# EAGLE design MotherboardRev1 (EAGLE 7.3.0)

## Sheet 1 of 8
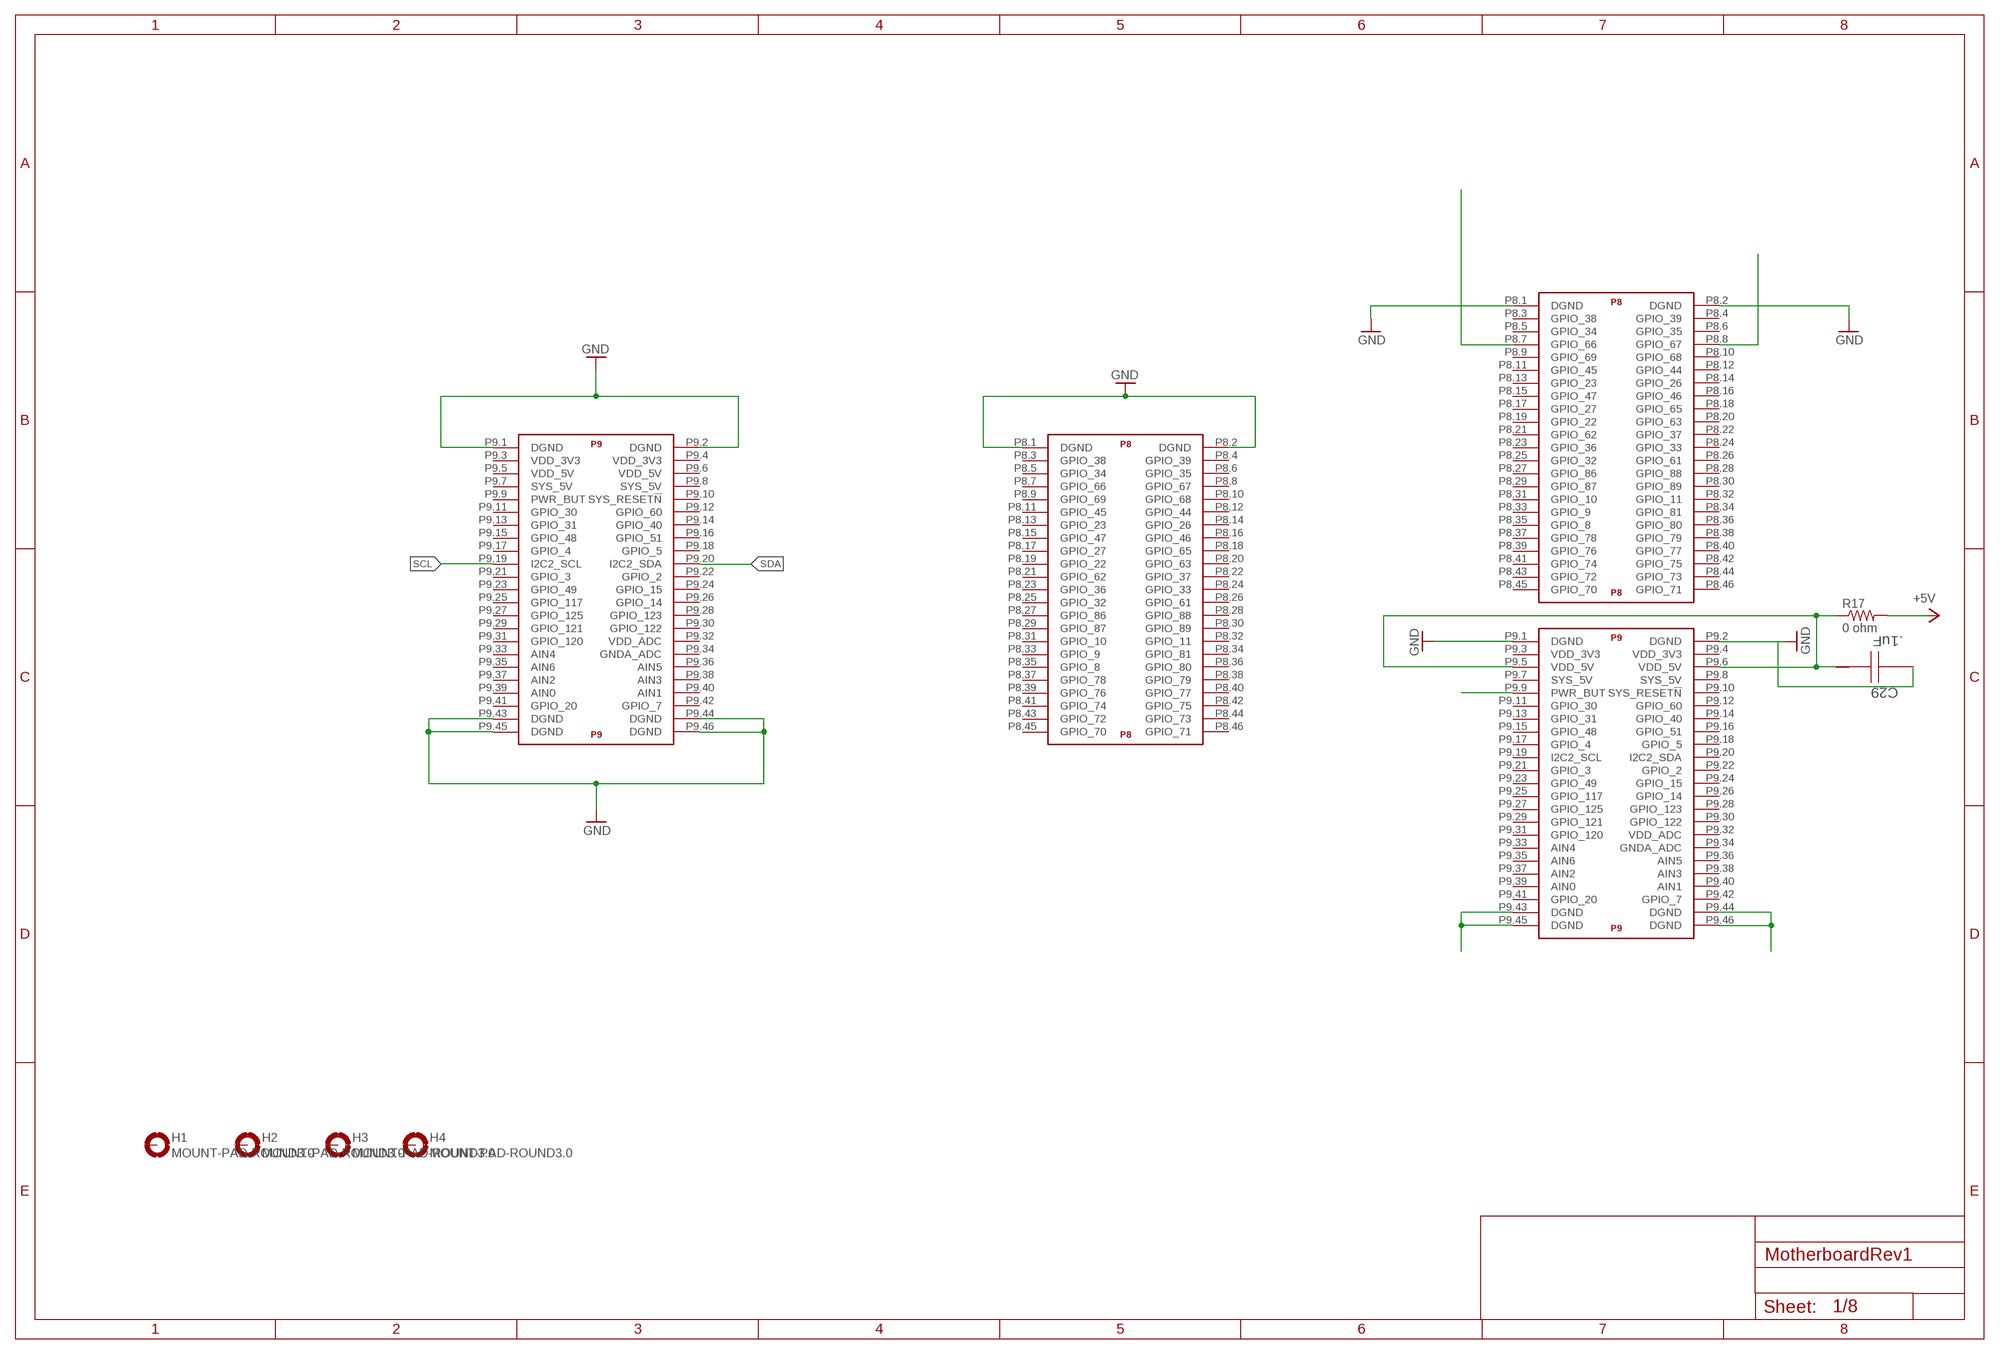
[diagram p0: schematic, sheet 1]

### Parts
C29  .1uF  C3216X5R1A106K  [1206]
H1  MOUNT-PAD-ROUND3.0  [3,0-PAD]
H2  MOUNT-PAD-ROUND3.0  [3,0-PAD]
H3  MOUNT-PAD-ROUND3.0  [3,0-PAD]
H4  MOUNT-PAD-ROUND3.0  [3,0-PAD]
R17  0 ohm  R-US_R1206  [R1206]
U$1  BEAGLE_BONE_BLACK_CAPE  [BEAGLE_BONE_BLACK_CAPE]
U$3  BEAGLE_BONE_BLACK_CAPE  [BEAGLE_BONE_BLACK_CAPE]

### Nets
+5V: R17.2 ; also sheet 3
BB_PWR_SW: U$3.P9.9(P9:PWR_BUT)
GND: C29.2 U$1.P8.1(P8:DGND) U$1.P8.2(P8:DGND) U$1.P9.1(P9:DGND) U$1.P9.2(P9:DGND) U$1.P9.43(P9:DGND) U$1.P9.44(P9:DGND) U$1.P9.45(P9:DGND) U$1.P9.46(P9:DGND) U$3.P8.1(P8:DGND) U$3.P8.2(P8:DGND) U$3.P9.1(P9:DGND) U$3.P9.2(P9:DGND) U$3.P9.43(P9:DGND) U$3.P9.44(P9:DGND) U$3.P9.45(P9:DGND) U$3.P9.46(P9:DGND) ; also sheet 5,6,7,8
N$11: C29.1 R17.1 U$3.P9.5(P9:VDD_5V) U$3.P9.6(P9:VDD_5V)
N$12: U$3.P8.7(P8:GPIO_66)
N$14: U$3.P8.8(P8:GPIO_67)
SCL: U$1.P9.19(P9:I2C2_SCL) ; also sheet 2
SDA: U$1.P9.20(P9:I2C2_SDA) ; also sheet 2
Unconnected: H1.B3,0(MOUNT) H2.B3,0(MOUNT) H3.B3,0(MOUNT) H4.B3,0(MOUNT) U$1.P8.3(P8:GPIO_38) U$1.P8.4(P8:GPIO_39) U$1.P8.5(P8:GPIO_34) U$1.P8.6(P8:GPIO_35) U$1.P8.7(P8:GPIO_66) U$1.P8.8(P8:GPIO_67) U$1.P8.9(P8:GPIO_69) U$1.P8.10(P8:GPIO_68) U$1.P8.11(P8:GPIO_45) U$1.P8.12(P8:GPIO_44) U$1.P8.13(P8:GPIO_23) U$1.P8.14(P8:GPIO_26) U$1.P8.15(P8:GPIO_47) U$1.P8.16(P8:GPIO_46) U$1.P8.17(P8:GPIO_27) U$1.P8.18(P8:GPIO_65) U$1.P8.19(P8:GPIO_22) U$1.P8.20(P8:GPIO_63) U$1.P8.21(P8:GPIO_62) U$1.P8.22(P8:GPIO_37) U$1.P8.23(P8:GPIO_36) U$1.P8.24(P8:GPIO_33) U$1.P8.25(P8:GPIO_32) U$1.P8.26(P8:GPIO_61) U$1.P8.27(P8:GPIO_86) U$1.P8.28(P8:GPIO_88) U$1.P8.29(P8:GPIO_87) U$1.P8.30(P8:GPIO_89) U$1.P8.31(P8:GPIO_10) U$1.P8.32(P8:GPIO_11) U$1.P8.33(P8:GPIO_9) U$1.P8.34(P8:GPIO_81) U$1.P8.35(P8:GPIO_8) U$1.P8.36(P8:GPIO_80) U$1.P8.37(P8:GPIO_78) U$1.P8.38(P8:GPIO_79) U$1.P8.39(P8:GPIO_76) U$1.P8.40(P8:GPIO_77) U$1.P8.41(P8:GPIO_74) U$1.P8.42(P8:GPIO_75) U$1.P8.43(P8:GPIO_72) U$1.P8.44(P8:GPIO_73) U$1.P8.45(P8:GPIO_70) U$1.P8.46(P8:GPIO_71) U$1.P9.3(P9:VDD_3V3) U$1.P9.4(P9:VDD_3V3) U$1.P9.5(P9:VDD_5V) U$1.P9.6(P9:VDD_5V) U$1.P9.7(P9:SYS_5V) U$1.P9.8(P9:SYS_5V) U$1.P9.9(P9:PWR_BUT) U$1.P9.10(P9:SYS_RESET!N) U$1.P9.11(P9:GPIO_30) U$1.P9.12(P9:GPIO_60) U$1.P9.13(P9:GPIO_31) U$1.P9.14(P9:GPIO_40) U$1.P9.15(P9:GPIO_48) U$1.P9.16(P9:GPIO_51) U$1.P9.17(P9:GPIO_4) U$1.P9.18(P9:GPIO_5) U$1.P9.21(P9:GPIO_3) U$1.P9.22(P9:GPIO_2) U$1.P9.23(P9:GPIO_49) U$1.P9.24(P9:GPIO_15) U$1.P9.25(P9:GPIO_117) U$1.P9.26(P9:GPIO_14) U$1.P9.27(P9:GPIO_125) U$1.P9.28(P9:GPIO_123) U$1.P9.29(P9:GPIO_121) U$1.P9.30(P9:GPIO_122) U$1.P9.31(P9:GPIO_120) U$1.P9.32(P9:VDD_ADC) U$1.P9.33(P9:AIN4) U$1.P9.34(P9:GNDA_ADC) U$1.P9.35(P9:AIN6) U$1.P9.36(P9:AIN5) U$1.P9.37(P9:AIN2) U$1.P9.38(P9:AIN3) U$1.P9.39(P9:AIN0) U$1.P9.40(P9:AIN1) U$1.P9.41(P9:GPIO_20) U$1.P9.42(P9:GPIO_7) U$3.P8.3(P8:GPIO_38) U$3.P8.4(P8:GPIO_39) U$3.P8.5(P8:GPIO_34) U$3.P8.6(P8:GPIO_35) U$3.P8.9(P8:GPIO_69) U$3.P8.10(P8:GPIO_68) U$3.P8.11(P8:GPIO_45) U$3.P8.12(P8:GPIO_44) U$3.P8.13(P8:GPIO_23) U$3.P8.14(P8:GPIO_26) U$3.P8.15(P8:GPIO_47) U$3.P8.16(P8:GPIO_46) U$3.P8.17(P8:GPIO_27) U$3.P8.18(P8:GPIO_65) U$3.P8.19(P8:GPIO_22) U$3.P8.20(P8:GPIO_63) U$3.P8.21(P8:GPIO_62) U$3.P8.22(P8:GPIO_37) U$3.P8.23(P8:GPIO_36) U$3.P8.24(P8:GPIO_33) U$3.P8.25(P8:GPIO_32) U$3.P8.26(P8:GPIO_61) U$3.P8.27(P8:GPIO_86) U$3.P8.28(P8:GPIO_88) U$3.P8.29(P8:GPIO_87) U$3.P8.30(P8:GPIO_89) U$3.P8.31(P8:GPIO_10) U$3.P8.32(P8:GPIO_11) U$3.P8.33(P8:GPIO_9) U$3.P8.34(P8:GPIO_81) U$3.P8.35(P8:GPIO_8) U$3.P8.36(P8:GPIO_80) U$3.P8.37(P8:GPIO_78) U$3.P8.38(P8:GPIO_79) U$3.P8.39(P8:GPIO_76) U$3.P8.40(P8:GPIO_77) U$3.P8.41(P8:GPIO_74) U$3.P8.42(P8:GPIO_75) U$3.P8.43(P8:GPIO_72) U$3.P8.44(P8:GPIO_73) U$3.P8.45(P8:GPIO_70) U$3.P8.46(P8:GPIO_71) U$3.P9.3(P9:VDD_3V3) U$3.P9.4(P9:VDD_3V3) U$3.P9.7(P9:SYS_5V) U$3.P9.8(P9:SYS_5V) U$3.P9.10(P9:SYS_RESET!N) U$3.P9.11(P9:GPIO_30) U$3.P9.12(P9:GPIO_60) U$3.P9.13(P9:GPIO_31) U$3.P9.14(P9:GPIO_40) U$3.P9.15(P9:GPIO_48) U$3.P9.16(P9:GPIO_51) U$3.P9.17(P9:GPIO_4) U$3.P9.18(P9:GPIO_5) U$3.P9.19(P9:I2C2_SCL) U$3.P9.20(P9:I2C2_SDA) U$3.P9.21(P9:GPIO_3) U$3.P9.22(P9:GPIO_2) U$3.P9.23(P9:GPIO_49) U$3.P9.24(P9:GPIO_15) U$3.P9.25(P9:GPIO_117) U$3.P9.26(P9:GPIO_14) U$3.P9.27(P9:GPIO_125) U$3.P9.28(P9:GPIO_123) U$3.P9.29(P9:GPIO_121) U$3.P9.30(P9:GPIO_122) U$3.P9.31(P9:GPIO_120) U$3.P9.32(P9:VDD_ADC) U$3.P9.33(P9:AIN4) U$3.P9.34(P9:GNDA_ADC) U$3.P9.35(P9:AIN6) U$3.P9.36(P9:AIN5) U$3.P9.37(P9:AIN2) U$3.P9.38(P9:AIN3) U$3.P9.39(P9:AIN0) U$3.P9.40(P9:AIN1) U$3.P9.41(P9:GPIO_20) U$3.P9.42(P9:GPIO_7)

## Sheet 2 of 8
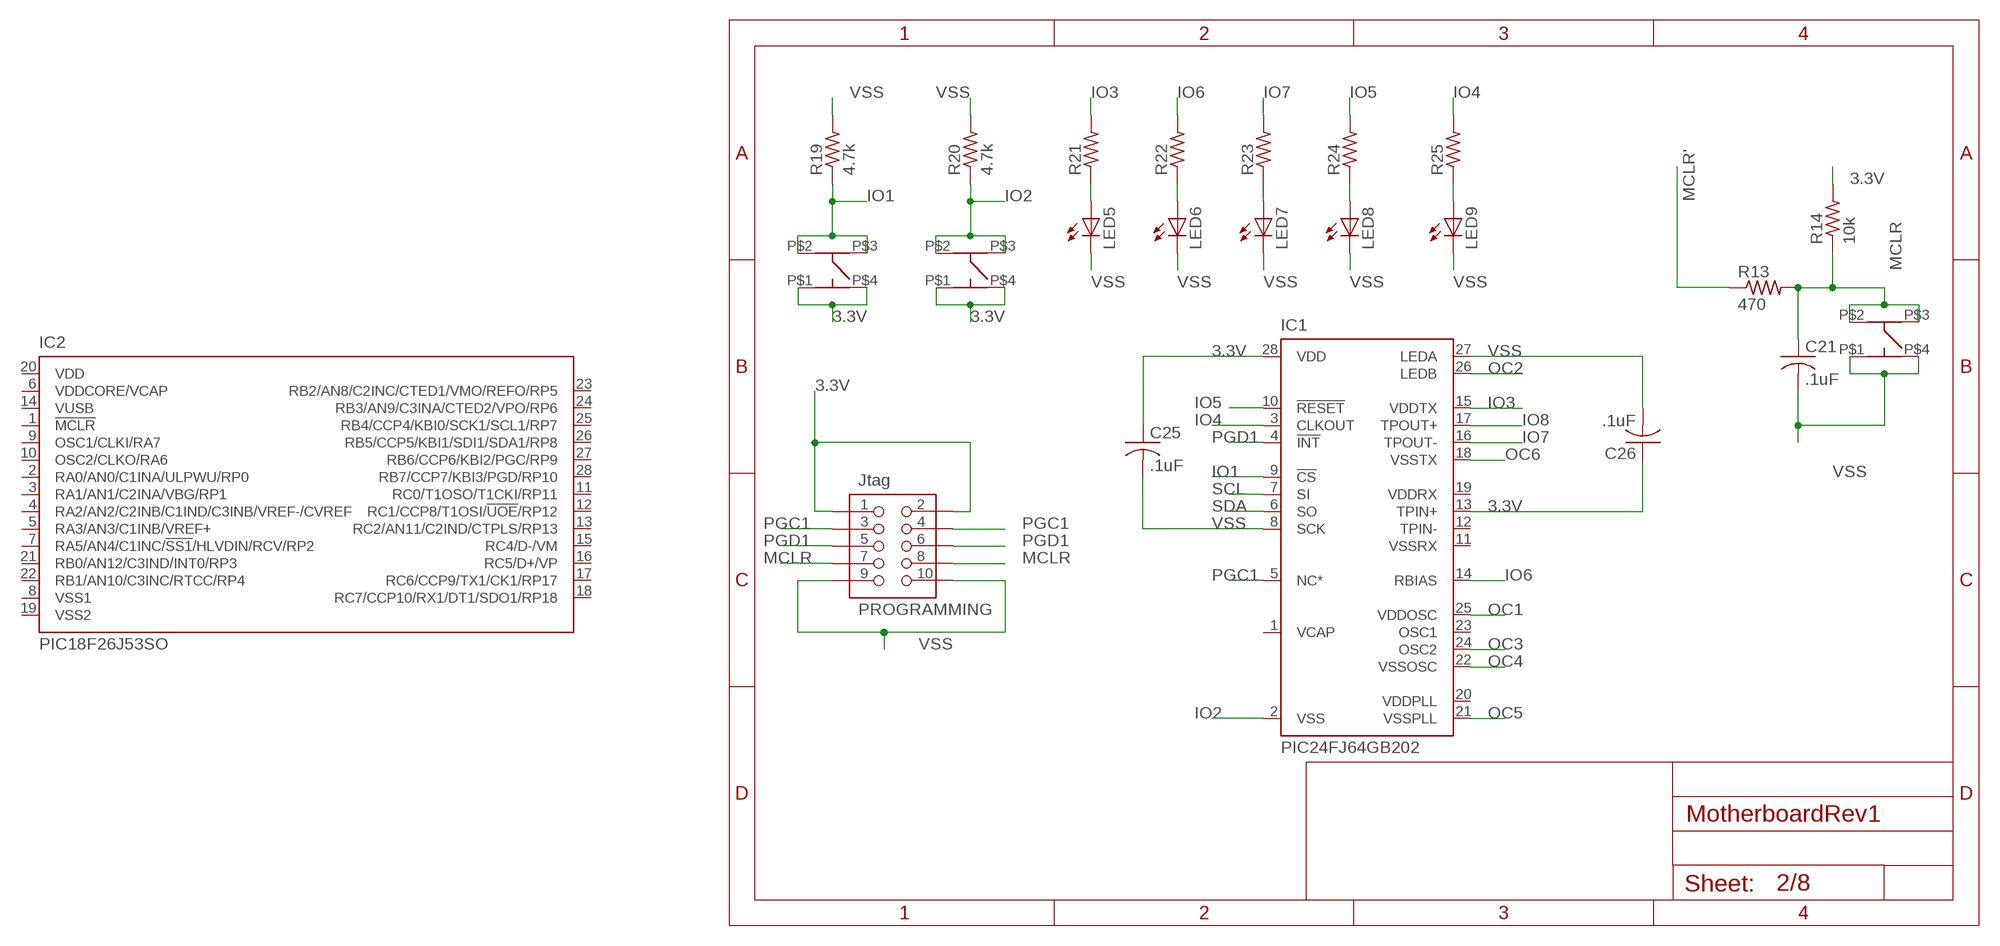
[diagram p1: schematic, sheet 2]

### Parts
C21  .1uF  C-USC0805  [C0805]
C25  .1uF  C-USC0805  [C0805]
C26  .1uF  C-USC0805  [C0805]
IC1  PIC24FJ64GB202  ENC28J60SP  [DIL28-3]
IC2  PIC18F26J53SO  [SO28W]
LED5  LED_LEDCHIPLED_1206  [LED_CHIPLED_1206]
LED6  LED_LEDCHIPLED_1206  [LED_CHIPLED_1206]
LED7  LED_LEDCHIPLED_1206  [LED_CHIPLED_1206]
LED8  LED_LEDCHIPLED_1206  [LED_CHIPLED_1206]
LED9  LED_LEDCHIPLED_1206  [LED_CHIPLED_1206]
PROGRAMMING  Jtag  MOTHER-BOARD-REV5_PIN-CONNECTOR74089  [MOTHER-BOARD-REV5_10-PIN-SMD]
R13  470  R-US_R0805  [R0805]
R14  10k  R-US_R0805  [R0805]
R19  4.7k  R-US_R0805  [R0805]
R20  4.7k  R-US_R0805  [R0805]
R21  R-US_M0805  [M0805]
R22  R-US_M0805  [M0805]
R23  R-US_M0805  [M0805]
R24  R-US_M0805  [M0805]
R25  R-US_M0805  [M0805]
U$5  Switch3  MC32882_SW  [MC32882_FINAL]
U$6  Switch1  MC32882_SW  [MC32882_FINAL]
U$7  Switch2  MC32882_SW  [MC32882_FINAL]

### Nets
3.3V: C25.1 C26.1 IC1.13(TPIN+) IC1.28(VDD) PROGRAMMING.1 PROGRAMMING.2 R14.2 U$6.P$1(P1) U$6.P$4(P4) U$7.P$1(P1) U$7.P$4(P4) ; also sheet 3
IO1: IC1.9(!CS) R19.1 U$6.P$2(P2) U$6.P$3(P3)
IO2: IC1.2(VSS) R20.1 U$7.P$2(P2) U$7.P$3(P3)
IO3: IC1.15(VDDTX) R21.2
IO4: IC1.3(CLKOUT) R25.2
IO5: IC1.10(!RESET) R24.2
IO6: IC1.14(RBIAS) R22.2
IO7: IC1.16(TPOUT-) R23.2
IO8: IC1.17(TPOUT+)
MCLR: C21.1 PROGRAMMING.7 PROGRAMMING.8 R13.2 R14.1 U$5.P$2(P2) U$5.P$3(P3)
MCLR': R13.1
N$5: LED5.A R21.1
N$6: LED6.A R22.1
N$7: LED7.A R23.1
N$8: LED8.A R24.1
N$9: LED9.A R25.1
OC1: IC1.25(VDDOSC) ; also sheet 4
OC2: IC1.26(LEDB) ; also sheet 4
OC3: IC1.24(OSC2) ; also sheet 4
OC4: IC1.22(VSSOSC) ; also sheet 4
OC5: IC1.21(VSSPLL) ; also sheet 4
OC6: IC1.18(VSSTX) ; also sheet 4
PGC1: IC1.5(NC*) PROGRAMMING.3 PROGRAMMING.4
PGD1: IC1.4(!INT) PROGRAMMING.5 PROGRAMMING.6
SCL: IC1.7(SI) ; also sheet 1
SDA: IC1.6(SO) ; also sheet 1
VSS: C21.2 C25.2 C26.2 IC1.8(SCK) IC1.27(LEDA) LED5.C LED6.C LED7.C LED8.C LED9.C PROGRAMMING.9 PROGRAMMING.10 R19.2 R20.2 U$5.P$1(P1) U$5.P$4(P4) ; also sheet 3,4
Unconnected: IC1.1(VCAP) IC1.11(VSSRX) IC1.12(TPIN-) IC1.19(VDDRX) IC1.20(VDDPLL) IC1.23(OSC1) IC2.1(!MCLR) IC2.2(RA0/AN0/C1INA/ULPWU/RP0) IC2.3(RA1/AN1/C2INA/VBG/RP1) IC2.4(RA2/AN2/C2INB/C1IND/C3INB/VREF-/CVREF) IC2.5(RA3/AN3/C1INB/VREF+) IC2.6(VDDCORE/VCAP) IC2.7(RA5/AN4/C1INC/!SS1!/HLVDIN/RCV/RP2) IC2.8(VSS1) IC2.9(OSC1/CLKI/RA7) IC2.10(OSC2/CLKO/RA6) IC2.11(RC0/T1OSO/T1CKI/RP11) IC2.12(RC1/CCP8/T1OSI/!UOE!/RP12) IC2.13(RC2/AN11/C2IND/CTPLS/RP13) IC2.14(VUSB) IC2.15(RC4/D-/VM) IC2.16(RC5/D+/VP) IC2.17(RC6/CCP9/TX1/CK1/RP17) IC2.18(RC7/CCP10/RX1/DT1/SDO1/RP18) IC2.19(VSS2) IC2.20(VDD) IC2.21(RB0/AN12/C3IND/INT0/RP3) IC2.22(RB1/AN10/C3INC/RTCC/RP4) IC2.23(RB2/AN8/C2INC/CTED1/VMO/REFO/RP5) IC2.24(RB3/AN9/C3INA/CTED2/VPO/RP6) IC2.25(RB4/CCP4/KBI0/SCK1/SCL1/RP7) IC2.26(RB5/CCP5/KBI1/SDI1/SDA1/RP8) IC2.27(RB6/CCP6/KBI2/PGC/RP9) IC2.28(RB7/CCP7/KBI3/PGD/RP10)

## Sheet 3 of 8: Power System
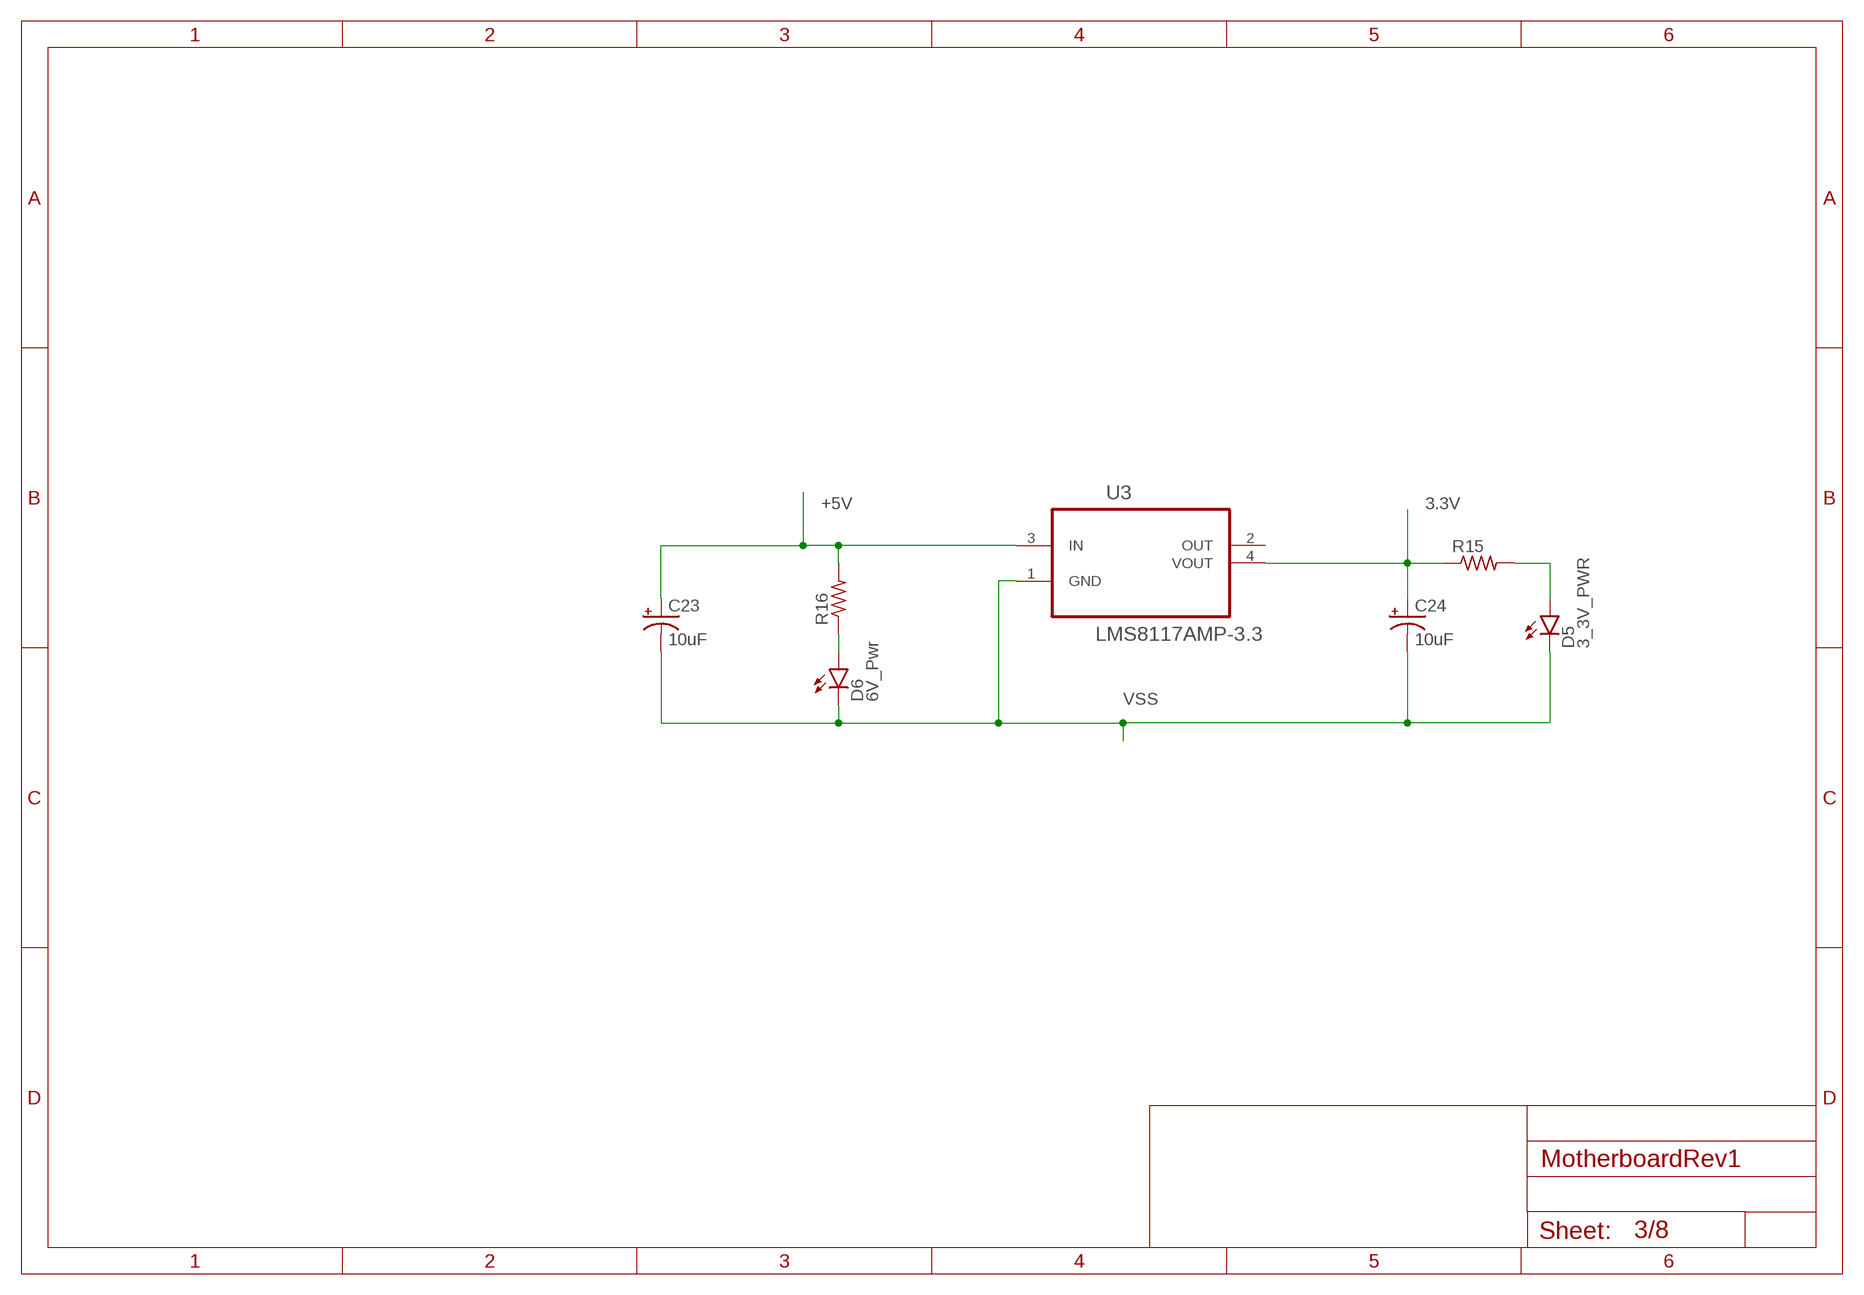
[diagram p2: schematic, sheet 3]

### Parts
C23  10uF  10UF-16V-10%(TANT)  [EIA3216]
C24  10uF  10UF-16V-10%(TANT)  [EIA3216]
D5  3_3V_PWR  LED-FKIT-1206  [FKIT-LED-1206]
D6  6V_Pwr  LED-FKIT-1206  [FKIT-LED-1206]
R15  R-US_R0805W  [R0805W]
R16  R-US_R0805W  [R0805W]
U3  LMS8117AMP-3.3  [SOT230P696X180-4N]

### Nets
3.3V: C24.A(+) R15.1 U3.4(VOUT) ; also sheet 2
+5V: C23.A(+) R16.2 U3.3(IN) ; also sheet 1
N$10: D5.A R15.2
N$13: D6.A R16.1
VSS: C23.C(-) C24.C(-) D5.C D6.C U3.1(GND) ; also sheet 2,4
Unconnected: U3.2(OUT)

## Sheet 4 of 8
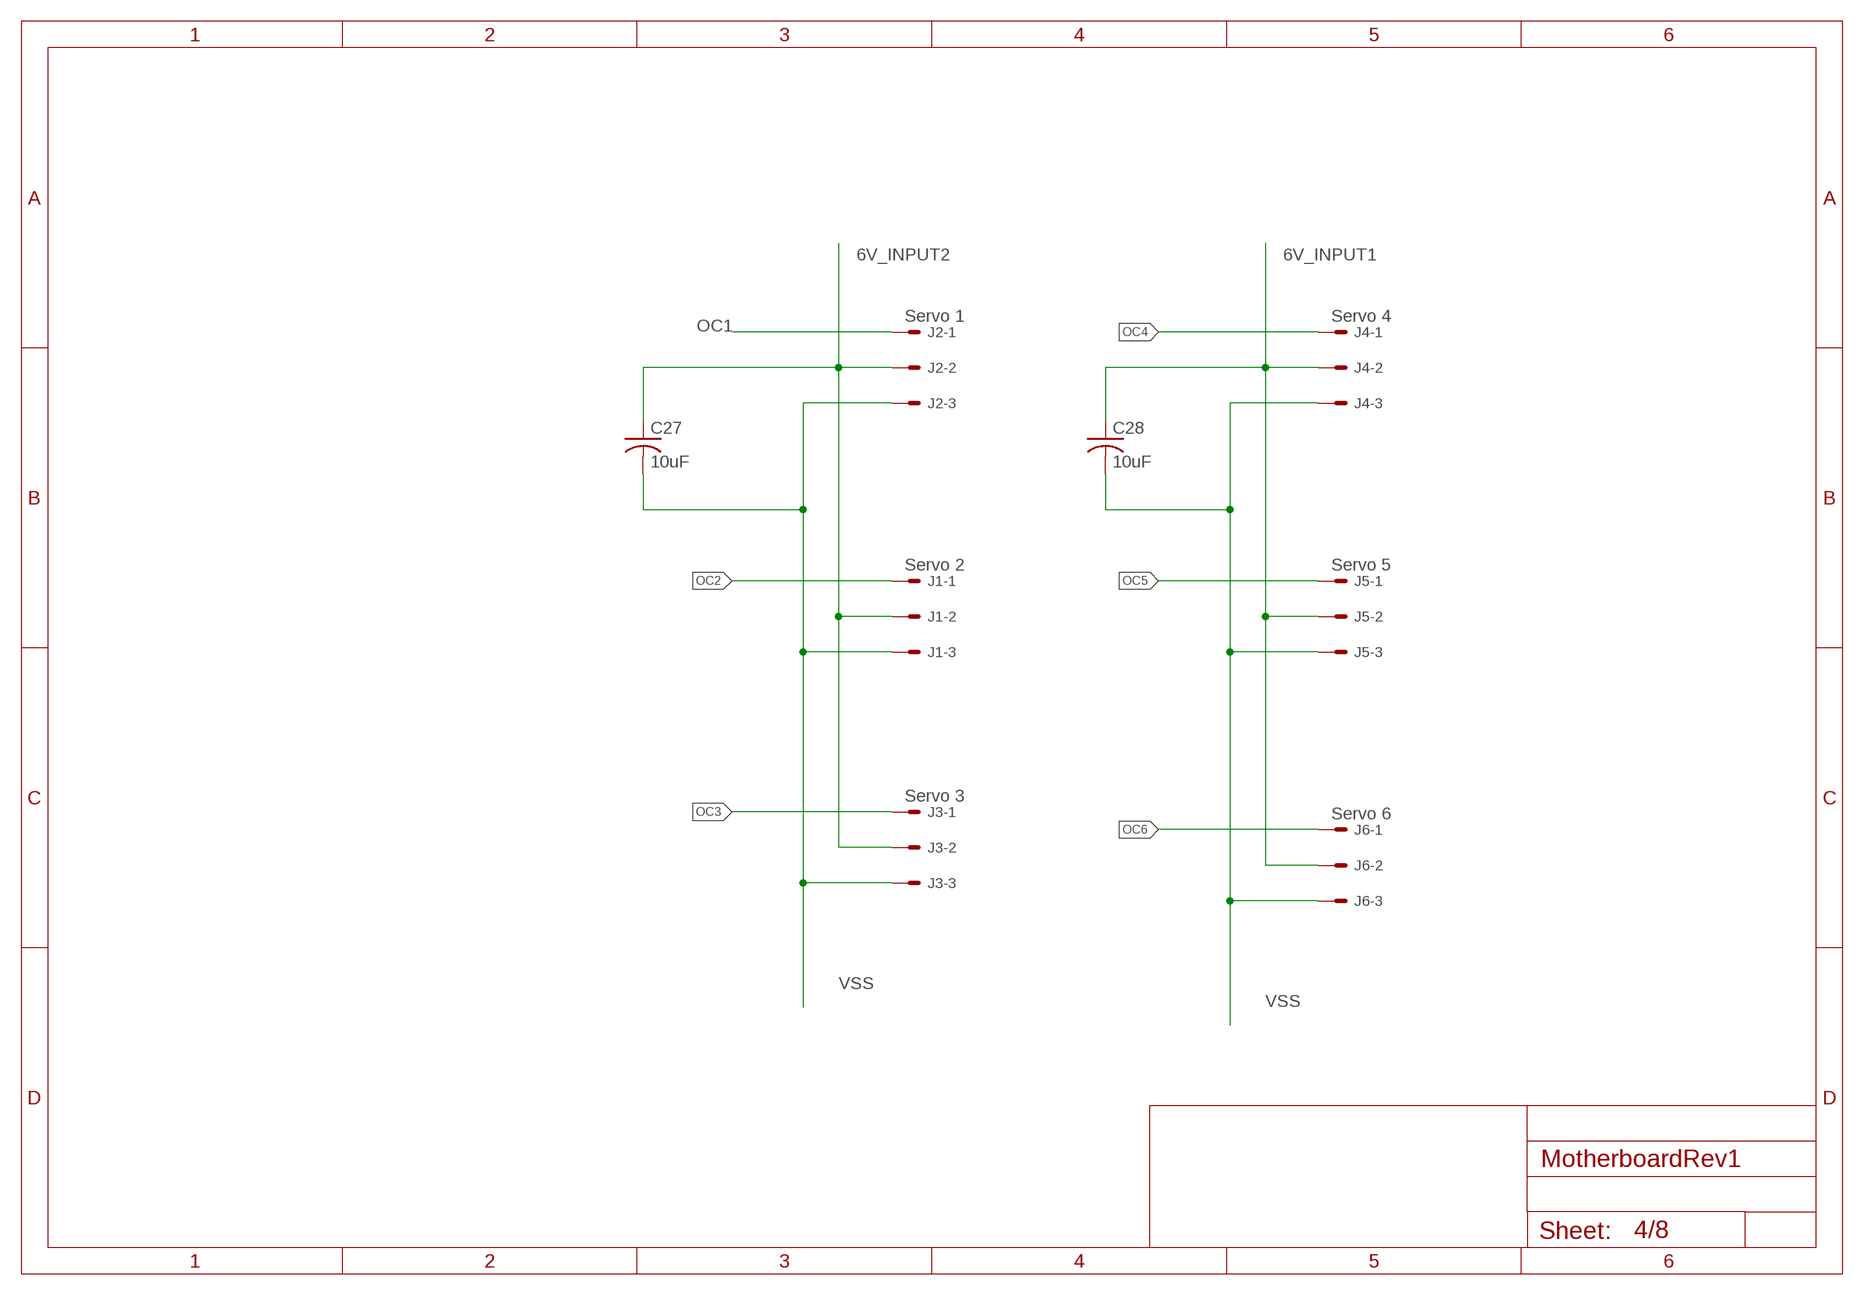
[diagram p3: schematic, sheet 4]

### Parts
C27  10uF  C-USC0805  [C0805]
C28  10uF  C-USC0805  [C0805]
J1  Servo 2  22-05-7038-03  [7395-03]
J2  Servo 1  22-05-7038-03  [7395-03]
J3  Servo 3  22-05-7038-03  [7395-03]
J4  Servo 4  22-05-7038-03  [7395-03]
J5  Servo 5  22-05-7038-03  [7395-03]
J6  Servo 6  22-05-7038-03  [7395-03]

### Nets
6V_INPUT1: C28.1 J4.2 J5.2 J6.2
6V_INPUT2: C27.1 J1.2 J2.2 J3.2
OC1: J2.1 ; also sheet 2
OC2: J1.1 ; also sheet 2
OC3: J3.1 ; also sheet 2
OC4: J4.1 ; also sheet 2
OC5: J5.1 ; also sheet 2
OC6: J6.1 ; also sheet 2
VSS: C27.2 C28.2 J1.3 J2.3 J3.3 J4.3 J5.3 J6.3 ; also sheet 2,3

## Sheet 5 of 8
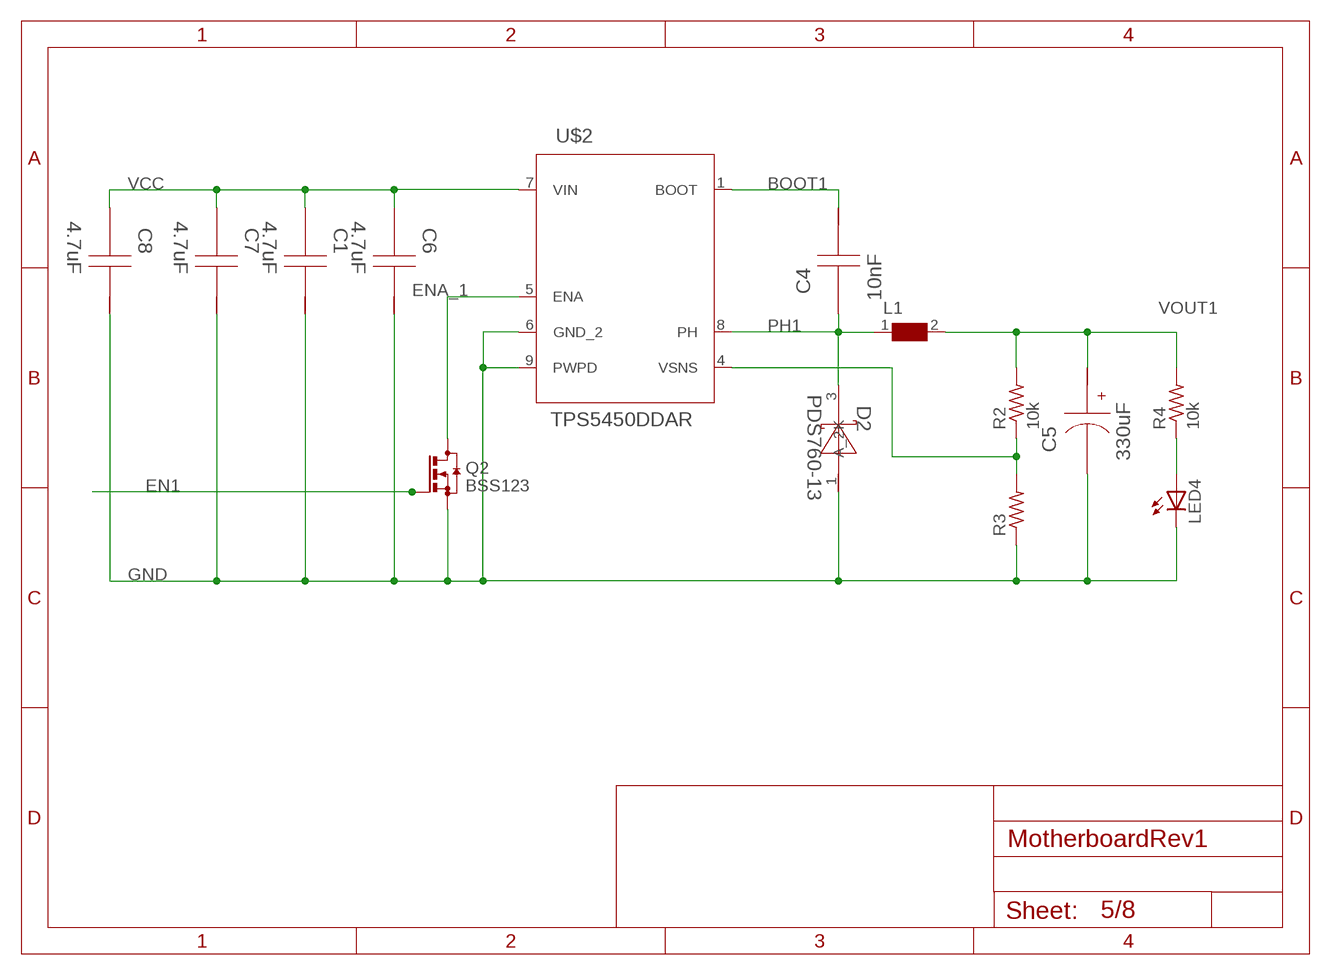
[diagram p4: schematic, sheet 5]

### Parts
C1  4.7uF  GRM31CR71H475KA12L  [1206]
C4  10nF  C0805C103K5RACTU  [0805]
C5  330uF  10SVP330MX  [SM_RADIAL_10AMM]
C6  4.7uF  GRM31CR71H475KA12L  [1206]
C7  4.7uF  GRM31CR71H475KA12L  [1206]
C8  4.7uF  GRM31CR71H475KA12L  [1206]
D2  PDS760-13  [POWERDI5]
L1  WE-HCC-7443331000_1090  [WE-HCC_1090]
LED4  LEDSML1206  [SML1206]
Q2  BSS123  [SOT23]
R2  10k  R-US_R1206  [R1206]
R3  R-US_R1206  [R1206]
R4  10k  R-US_R1206  [R1206]
U$2  TPS5450DDAR  [R-PDSO-G8]

### Nets
BOOT1: C4.1 U$2.1(BOOT)
EN1: Q2.1(G)
ENA_1: Q2.3(D) U$2.5(ENA)
GND: C1.1 C5.2(-) C6.1 C7.1 C8.1 D2.1(A_2) LED4.C Q2.2(S) R3.1 U$2.6(GND_2) U$2.9(PWPD) ; also sheet 1,6,7,8
N$1: LED4.A R4.1
PH1: C4.2 D2.3(K) L1.1 U$2.8(PH)
VCC: C1.2 C6.2 C7.2 C8.2 U$2.7(VIN) ; also sheet 6,7,8
VOUT1: C5.1(+) L1.2 R2.2 R4.2
VSNS1: R2.1 R3.2 U$2.4(VSNS)

## Sheet 6 of 8
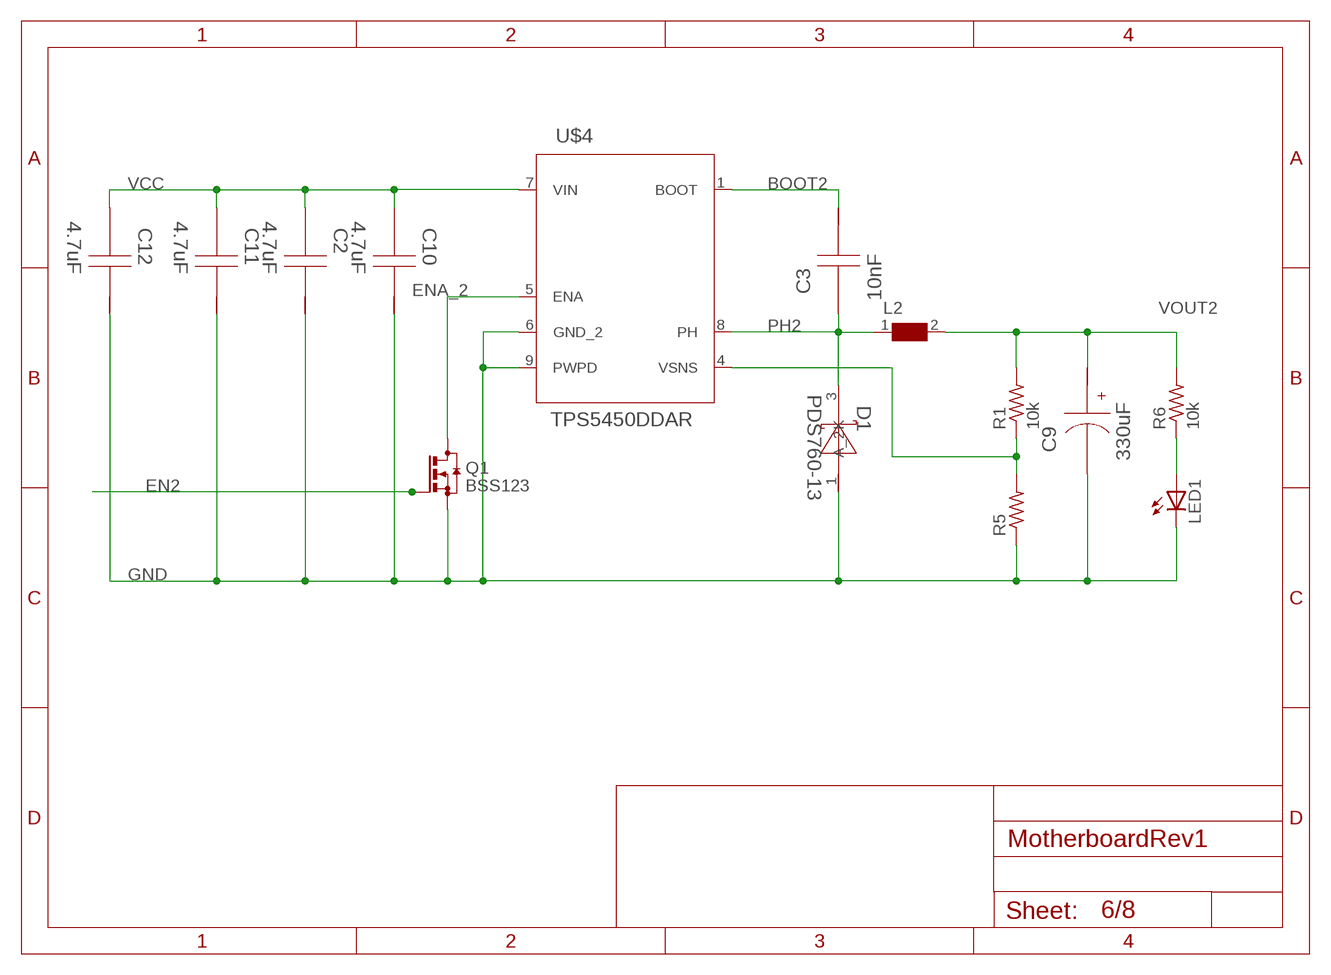
[diagram p5: schematic, sheet 6]

### Parts
C2  4.7uF  GRM31CR71H475KA12L  [1206]
C3  10nF  C0805C103K5RACTU  [0805]
C9  330uF  10SVP330MX  [SM_RADIAL_10AMM]
C10  4.7uF  GRM31CR71H475KA12L  [1206]
C11  4.7uF  GRM31CR71H475KA12L  [1206]
C12  4.7uF  GRM31CR71H475KA12L  [1206]
D1  PDS760-13  [POWERDI5]
L2  WE-HCC-7443331000_1090  [WE-HCC_1090]
LED1  LEDSML1206  [SML1206]
Q1  BSS123  [SOT23]
R1  10k  R-US_R1206  [R1206]
R5  R-US_R1206  [R1206]
R6  10k  R-US_R1206  [R1206]
U$4  TPS5450DDAR  [R-PDSO-G8]

### Nets
BOOT2: C3.1 U$4.1(BOOT)
EN2: Q1.1(G)
ENA_2: Q1.3(D) U$4.5(ENA)
GND: C2.1 C9.2(-) C10.1 C11.1 C12.1 D1.1(A_2) LED1.C Q1.2(S) R5.1 U$4.6(GND_2) U$4.9(PWPD) ; also sheet 1,5,7,8
N$2: LED1.A R6.1
PH2: C3.2 D1.3(K) L2.1 U$4.8(PH)
VCC: C2.2 C10.2 C11.2 C12.2 U$4.7(VIN) ; also sheet 5,7,8
VOUT2: C9.1(+) L2.2 R1.2 R6.2
VSNS2: R1.1 R5.2 U$4.4(VSNS)

## Sheet 7 of 8
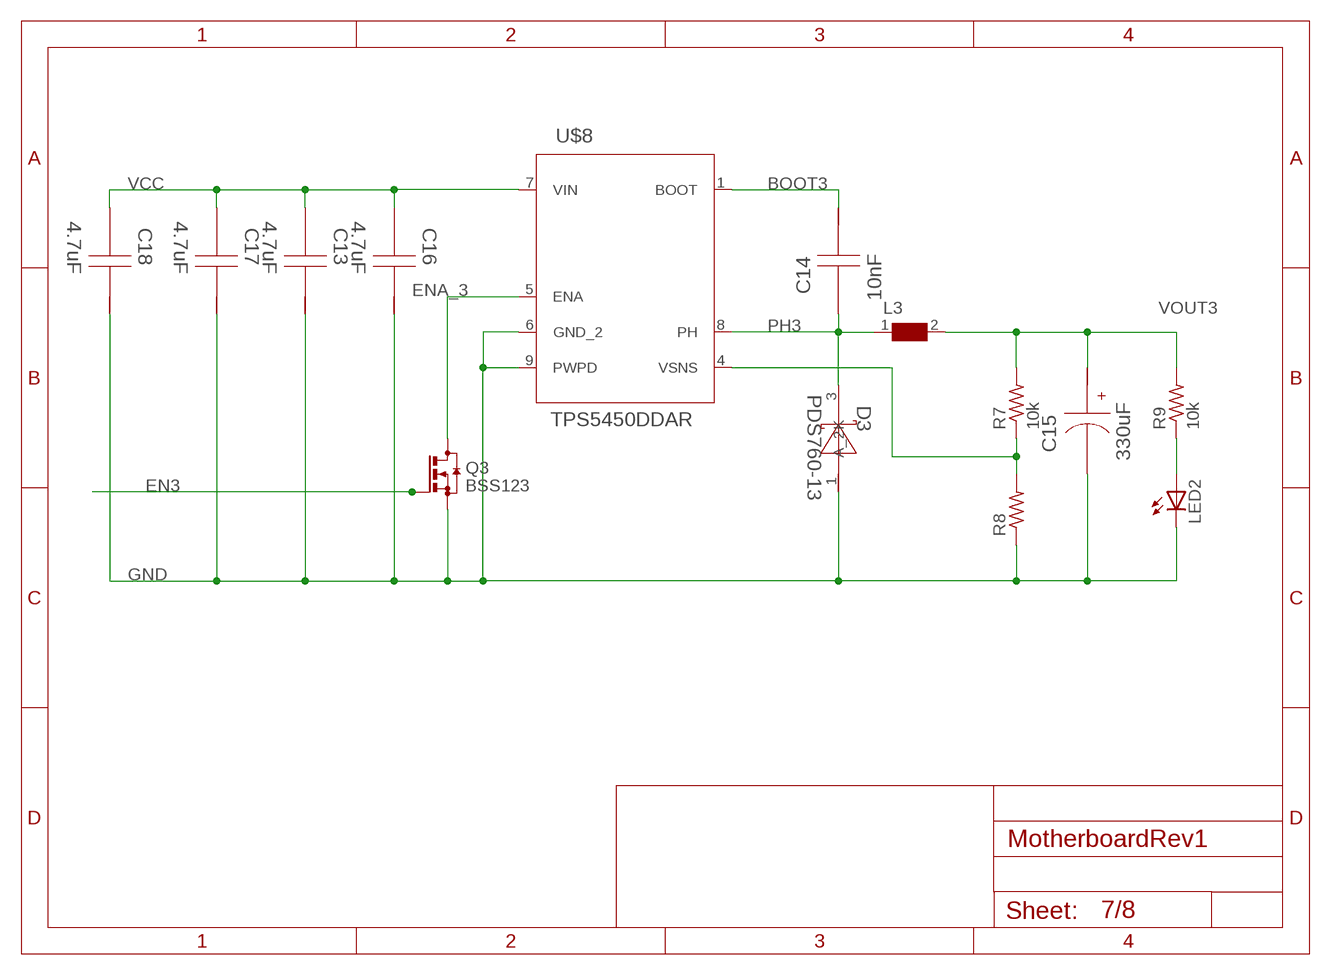
[diagram p6: schematic, sheet 7]

### Parts
C13  4.7uF  GRM31CR71H475KA12L  [1206]
C14  10nF  C0805C103K5RACTU  [0805]
C15  330uF  10SVP330MX  [SM_RADIAL_10AMM]
C16  4.7uF  GRM31CR71H475KA12L  [1206]
C17  4.7uF  GRM31CR71H475KA12L  [1206]
C18  4.7uF  GRM31CR71H475KA12L  [1206]
D3  PDS760-13  [POWERDI5]
L3  WE-HCC-7443331000_1090  [WE-HCC_1090]
LED2  LEDSML1206  [SML1206]
Q3  BSS123  [SOT23]
R7  10k  R-US_R1206  [R1206]
R8  R-US_R1206  [R1206]
R9  10k  R-US_R1206  [R1206]
U$8  TPS5450DDAR  [R-PDSO-G8]

### Nets
BOOT3: C14.1 U$8.1(BOOT)
EN3: Q3.1(G)
ENA_3: Q3.3(D) U$8.5(ENA)
GND: C13.1 C15.2(-) C16.1 C17.1 C18.1 D3.1(A_2) LED2.C Q3.2(S) R8.1 U$8.6(GND_2) U$8.9(PWPD) ; also sheet 1,5,6,8
N$3: LED2.A R9.1
PH3: C14.2 D3.3(K) L3.1 U$8.8(PH)
VCC: C13.2 C16.2 C17.2 C18.2 U$8.7(VIN) ; also sheet 5,6,8
VOUT3: C15.1(+) L3.2 R7.2 R9.2
VSNS3: R7.1 R8.2 U$8.4(VSNS)

## Sheet 8 of 8
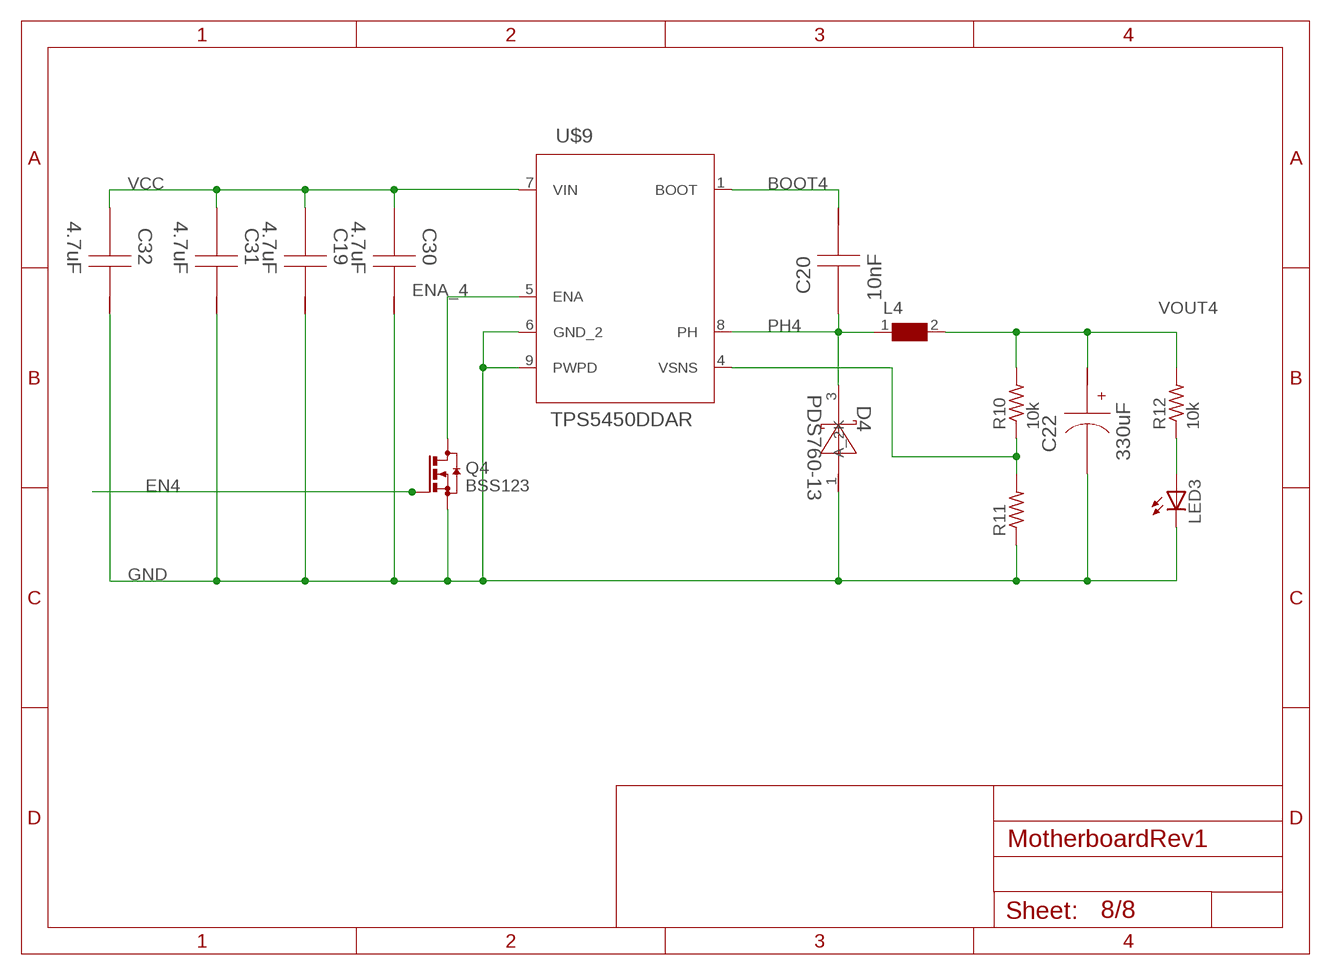
[diagram p7: schematic, sheet 8]

### Parts
C19  4.7uF  GRM31CR71H475KA12L  [1206]
C20  10nF  C0805C103K5RACTU  [0805]
C22  330uF  10SVP330MX  [SM_RADIAL_10AMM]
C30  4.7uF  GRM31CR71H475KA12L  [1206]
C31  4.7uF  GRM31CR71H475KA12L  [1206]
C32  4.7uF  GRM31CR71H475KA12L  [1206]
D4  PDS760-13  [POWERDI5]
L4  WE-HCC-7443331000_1090  [WE-HCC_1090]
LED3  LEDSML1206  [SML1206]
Q4  BSS123  [SOT23]
R10  10k  R-US_R1206  [R1206]
R11  R-US_R1206  [R1206]
R12  10k  R-US_R1206  [R1206]
U$9  TPS5450DDAR  [R-PDSO-G8]

### Nets
BOOT4: C20.1 U$9.1(BOOT)
EN4: Q4.1(G)
ENA_4: Q4.3(D) U$9.5(ENA)
GND: C19.1 C22.2(-) C30.1 C31.1 C32.1 D4.1(A_2) LED3.C Q4.2(S) R11.1 U$9.6(GND_2) U$9.9(PWPD) ; also sheet 1,5,6,7
N$4: LED3.A R12.1
PH4: C20.2 D4.3(K) L4.1 U$9.8(PH)
VCC: C19.2 C30.2 C31.2 C32.2 U$9.7(VIN) ; also sheet 5,6,7
VOUT4: C22.1(+) L4.2 R10.2 R12.2
VSNS4: R10.1 R11.2 U$9.4(VSNS)

## Library data of the parts
C1 C2 C6-C8 C10-C13 C16-C19 C30-C32 = 5v:GRM31CR71H475KA12L; CAP: 4.7E-6; ESR: 0.0; IRMS: 0.0; MANUFACTURER_NAME: MuRata; MANUFACTURER_PART_NUMBER: GRM31CR71H475KA12L; VDC: 50.0; VENDOR: MuRata
C3 C4 C14 C20 = 5v:C0805C103K5RACTU; CAP: 1.0E-8; ESR: 1.739; IRMS: 0.411; MANUFACTURER_NAME: Kemet; MANUFACTURER_PART_NUMBER: C0805C103K5RACTU; VDC: 50.0; VENDOR: Kemet
C5 C9 C15 C22 = 5v:10SVP330MX; CAP: 3.3E-4; DATASHEETURL: http://www.edc.sanyo.com/english/pdf/oscon/E32.pdf; ESR: 0.025; IRMS: 3.7; MANUFACTURER_NAME: Panasonic; MANUFACTURER_PART_NUMBER: 10SVP330MX; VDC: 10.0; VENDOR: Panasonic
C21 C25-C28 = rcl:C-US: CAPACITOR, American symbol
C23 C24 = SparkFun-Capacitors:10UF-16V-10%(TANT): CAP-00811 1206/EIA-3216 Tantalum capacitor; PROD_ID: CAP-00811
C29 = 3-3_fixed:C3216X5R1A106K; CAP: 1.0E-5; DATASHEETURL: http://www.tdk.co.jp/tefe02/e3999%5Fc.pdf; ESR: 0.00306; IRMS: 0.0; MANUFACTURER_PART_NUMBER: C3216X5R1A106K; VDC: 10.0; VENDOR: TDK
D1-D4 = 5v:PDS760-13; DATASHEETURL: www.diodes.com/datasheets/ds30477.pdf; IO: 7.0; MANUFACTURER_NAME: Diodes Inc.; MANUFACTURER_PART_NUMBER: PDS760-13; VENDOR: Diodes Inc.; VFATIO: 0.56; VRRM: 60.0
D5 D6 = SparkFun-LED:LED: LEDs Standard schematic elements and footprints for 5mm, 3mm, 1206, and 0603 sized LEDs. 5mm - Spark Fun Electronics SKU : COM-00529 (and others)
H1-H4 = holes:MOUNT-PAD-ROUND: MOUNTING PAD, round
IC1 = microchip:ENC28J60: Stand-Alone Ethernet Controller with SPI Interface Source: http://ww1.microchip.com/downloads/en/DeviceDoc/39662c.pdf; MF: MICROCHIP; MPN: ENC28J60/SP; OC_FARNELL: 1084619; OC_NEWARK: 96K3661
IC2 = microchip:PIC18F2*J53: PIC18F47J53 Family High-Performance USB Microcontrollers with nanoWatt XLP Technology Source: Data sheet <http://ww1.microchip.com/downloads/en/DeviceDoc/39964B.pdf>; MPN: PIC18F26J53-I/SO; OC_FARNELL: unknown; OC_NEWARK: 63R7830
J1-J6 = con-molex:22-?-03: CONNECTOR wire to board 2.54 mm (.1 inch) pitch header; OC_FARNELL: unknown; OC_NEWARK: unknown
L1-L4 = WE-HCC:WE-HCC: SMD High Current Cube Inductor WE-HCC - magnetically shieled - current capability up to 27A - excellent saturation characteristics -- filter choke for DC/DC converter -- single and polyphase buck converter -- filter choke for motor electronics; MPN: 7443331000; OC_FARNELL: 1848254; OC_NEWARK: 13T9771; PACKAGE: 1090; SUPPLIER: Wuerth Elektronik
LED1-LED4 = led:LED: LED OSRAM: - CHIPLED LG R971, LG N971, LY N971, LG Q971, LY Q971, LO R971, LY R971 LH N974, LH R974 LS Q976, LO Q976, LY Q976 LO Q996 - Hyper CHIPLED LW Q18S LB Q993, LB Q99A, LB R99A - SideLED LS A670, LO A670, LY A670, LG A670, LP A670 LB A673, LV A673, LT A673, LW A673 LH A674 LY A675 LS A676, LA A676, LO A676, LY A676, LW A676 LS A679, LY A679, LG A679 - Hyper Micro SIDELED® LS Y876, LA Y876, LO Y876, LY Y876 LT Y87S - SmartLED LW L88C, LW L88S LB L89C, LB L89S, LG L890 LS L89K, LO L89K, LY L89K LS L896, LA L896, LO L896, LY L896 - TOPLED LS T670, LO T670, LY T670, LG T670, LP T670 LSG T670, LSP T670, LSY T670, LOP T670, LYG T670 LG T671, LOG T671, LSG T671 LB T673, LV T673, LT T673, LW T673 LH T674 LS T676, LA T676, LO T676, LY T676, LB T676, LH T676, LSB T676, LW T676 LB T67C, LV T67C, LT T67C, LS T67K, LO T67K, LY T67K, LW E67C LS E67B, LA E67B, LO E67B, LY E67B, LB E67C, LV E67C, LT E67C LW T67C LS T679, LY T679, LG T679 LS T770, LO T770, LY T770, LG T770, LP T770 LB T773, LV T773, LT T773, LW T773 LH T774 LS E675, LA E675, LY E675, LS T675 LS T776, LA T776, LO T776, LY T776, LB T776 LHGB T686 LT T68C, LB T68C - Hyper Mini TOPLED® LB M676 - Mini TOPLED Santana® LG M470 LS M47K, LO M47K, LY M47K Source: http://www.osram.convergy.de LUXEON: - LUMILED® LXK2-PW12-R00, LXK2-PW12-S00, LXK2-PW14-U00, LXK2-PW14-V00 LXK2-PM12-R00, LXK2-PM12-S00, LXK2-PM14-U00 LXK2-PE12-Q00, LXK2-PE12-R00, LXK2-PE12-S00, LXK2-PE14-T00, LXK2-PE14-U00 LXK2-PB12-K00, LXK2-PB12-L00, LXK2-PB12-M00, LXK2-PB14-N00, LXK2-PB14-P00, LXK2-PB14-Q00 LXK2-PR12-L00, LXK2-PR12-M00, LXK2-PR14-Q00, LXK2-PR14-R00 LXK2-PD12-Q00, LXK2-PD12-R00, LXK2-PD12-S00 LXK2-PH12-R00, LXK2-PH12-S00 LXK2-PL12-P00, LXK2-PL12-Q00, LXK2-PL12-R00 Source: www.luxeon.com KINGBRIGHT: KA-3528ASYC Source: www.kingbright.com
LED5-LED9 = motherboard_i_autoroute:LED_LED: LED OSRAM: - CHIPLED LG R971, LG N971, LY N971, LG Q971, LY Q971, LO R971, LY R971 LH N974, LH R974 LS Q976, LO Q976, LY Q976 LO Q996 - Hyper CHIPLED LW Q18S LB Q993, LB Q99A, LB R99A - SideLED LS A670, LO A670, LY A670, LG A670, LP A670 LB A673, LV A673, LT A673, LW A673 LH A674 LY A675 LS A676, LA A676, LO A676, LY A676, LW A676 LS A679, LY A679, LG A679 - Hyper Micro SIDELED® LS Y876, LA Y876, LO Y876, LY Y876 LT Y87S - SmartLED LW L88C, LW L88S LB L89C, LB L89S, LG L890 LS L89K, LO L89K, LY L89K LS L896, LA L896, LO L896, LY L896 - TOPLED LS T670, LO T670, LY T670, LG T670, LP T670 LSG T670, LSP T670, LSY T670, LOP T670, LYG T670 LG T671, LOG T671, LSG T671 LB T673, LV T673, LT T673, LW T673 LH T674 LS T676, LA T676, LO T676, LY T676, LB T676, LH T676, LSB T676, LW T676 LB T67C, LV T67C, LT T67C, LS T67K, LO T67K, LY T67K, LW E67C LS E67B, LA E67B, LO E67B, LY E67B, LB E67C, LV E67C, LT E67C LW T67C LS T679, LY T679, LG T679 LS T770, LO T770, LY T770, LG T770, LP T770 LB T773, LV T773, LT T773, LW T773 LH T774 LS E675, LA E675, LY E675, LS T675 LS T776, LA T776, LO T776, LY T776, LB T776 LHGB T686 LT T68C, LB T68C - Hyper Mini TOPLED® LB M676 - Mini TOPLED Santana® LG M470 LS M47K, LO M47K, LY M47K Source: http://www.osram.convergy.de LUXEON: - LUMILED® LXK2-PW12-R00, LXK2-PW12-S00, LXK2-PW14-U00, LXK2-PW14-V00 LXK2-PM12-R00, LXK2-PM12-S00, LXK2-PM14-U00 LXK2-PE12-Q00, LXK2-PE12-R00, LXK2-PE12-S00, LXK2-PE14-T00, LXK2-PE14-U00 LXK2-PB12-K00, LXK2-PB12-L00, LXK2-PB12-M00, LXK2-PB14-N00, LXK2-PB14-P00, LXK2-PB14-Q00 LXK2-PR12-L00, LXK2-PR12-M00, LXK2-PR14-Q00, LXK2-PR14-R00 LXK2-PD12-Q00, LXK2-PD12-R00, LXK2-PD12-S00 LXK2-PH12-R00, LXK2-PH12-S00 LXK2-PL12-P00, LXK2-PL12-Q00, LXK2-PL12-R00 Source: www.luxeon.com KINGBRIGHT: KA-3528ASYC Source: www.kingbright.com
PROGRAMMING = Mother-Board-rev5:MOTHER-BOARD-REV5_PIN-CONNECTOR
Q1-Q4 = transistor-small-signal:BSS123: N-CHANNEL MOS FET
R1-R17 R19-R25 = rcl:R-US_: RESISTOR, American symbol
U3 = NSC-LMS8117AMP:LMS8117AMP-3.3: Low-Dropout Linear Regulator; MPN: LMS8117AMP-3.3; OC_FARNELL: 1469032; OC_NEWARK: 41K3020; PACKAGE: SOT-223-3; SUPPLIER: National Semiconductor
U$1 = Son_of_Dark_Powersch:BEAGLE_BONE_BLACK_CAPE
U$2 U$4 U$8 U$9 = 5v:TPS5450DDAR; DATASHEETURL: http://www.ti.com/product/tps5450; FREQUENCY: 500000.0; IMAX: 5.0; MANUFACTURER_NAME: Texas Instruments; MANUFACTURER_PART_NUMBER: TPS5450DDA; MKTG_PACKAGE: TPS5450; NSID: TPS5450DDAR; PACKAGE: TPS5450; VENDOR: Texas Instruments
U$3 = SparkFun-Boards:BEAGLE_BONE_BLACK_CAPE
U$5-U$7 = Parts4Class:MC32882_SW

## Net classes
0 default: width 0.203 mm, drill 0.508 mm, clearance 0.254 mm

## Board
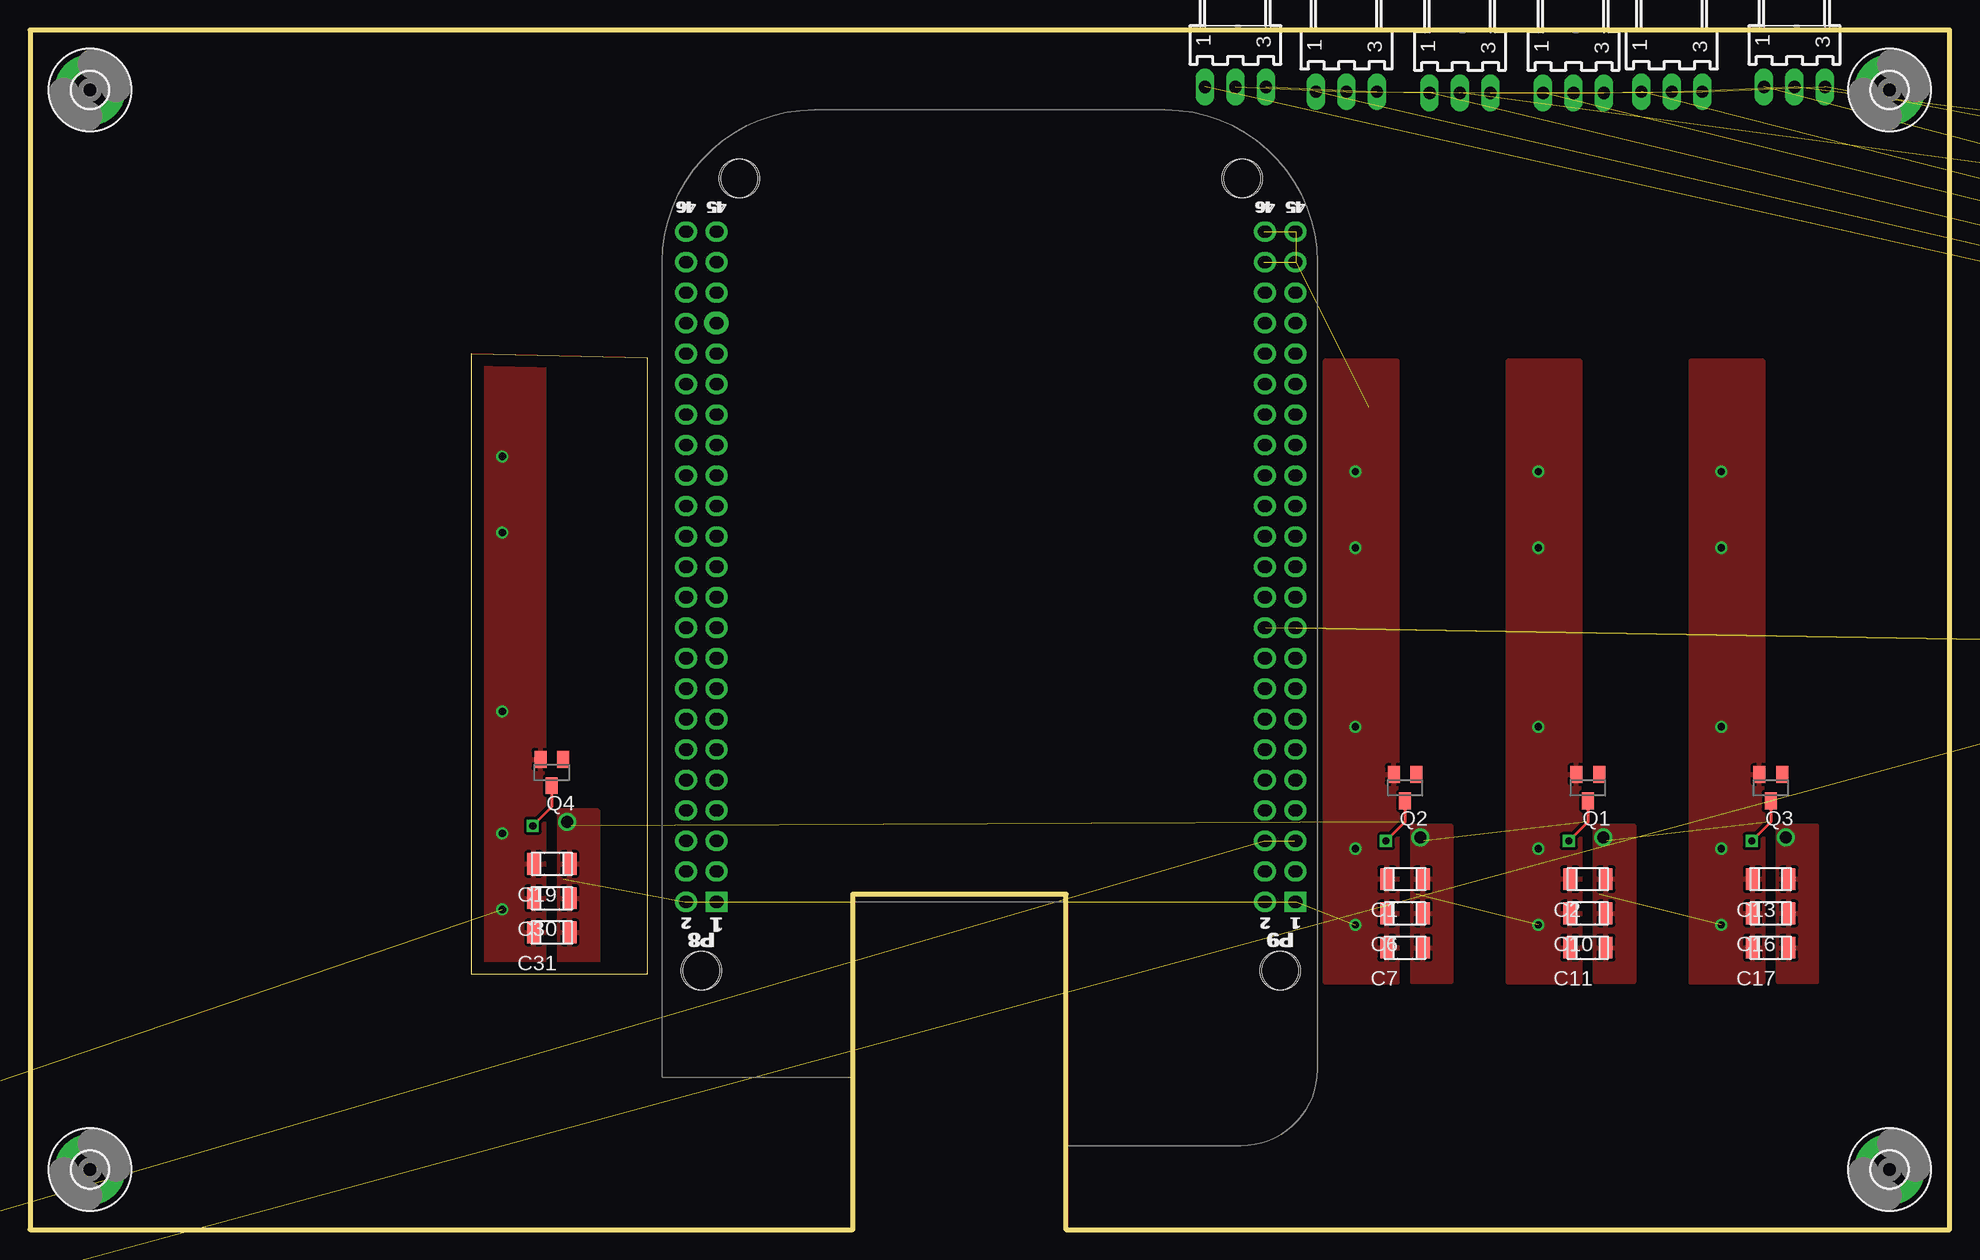
[diagram p8: board, top side]
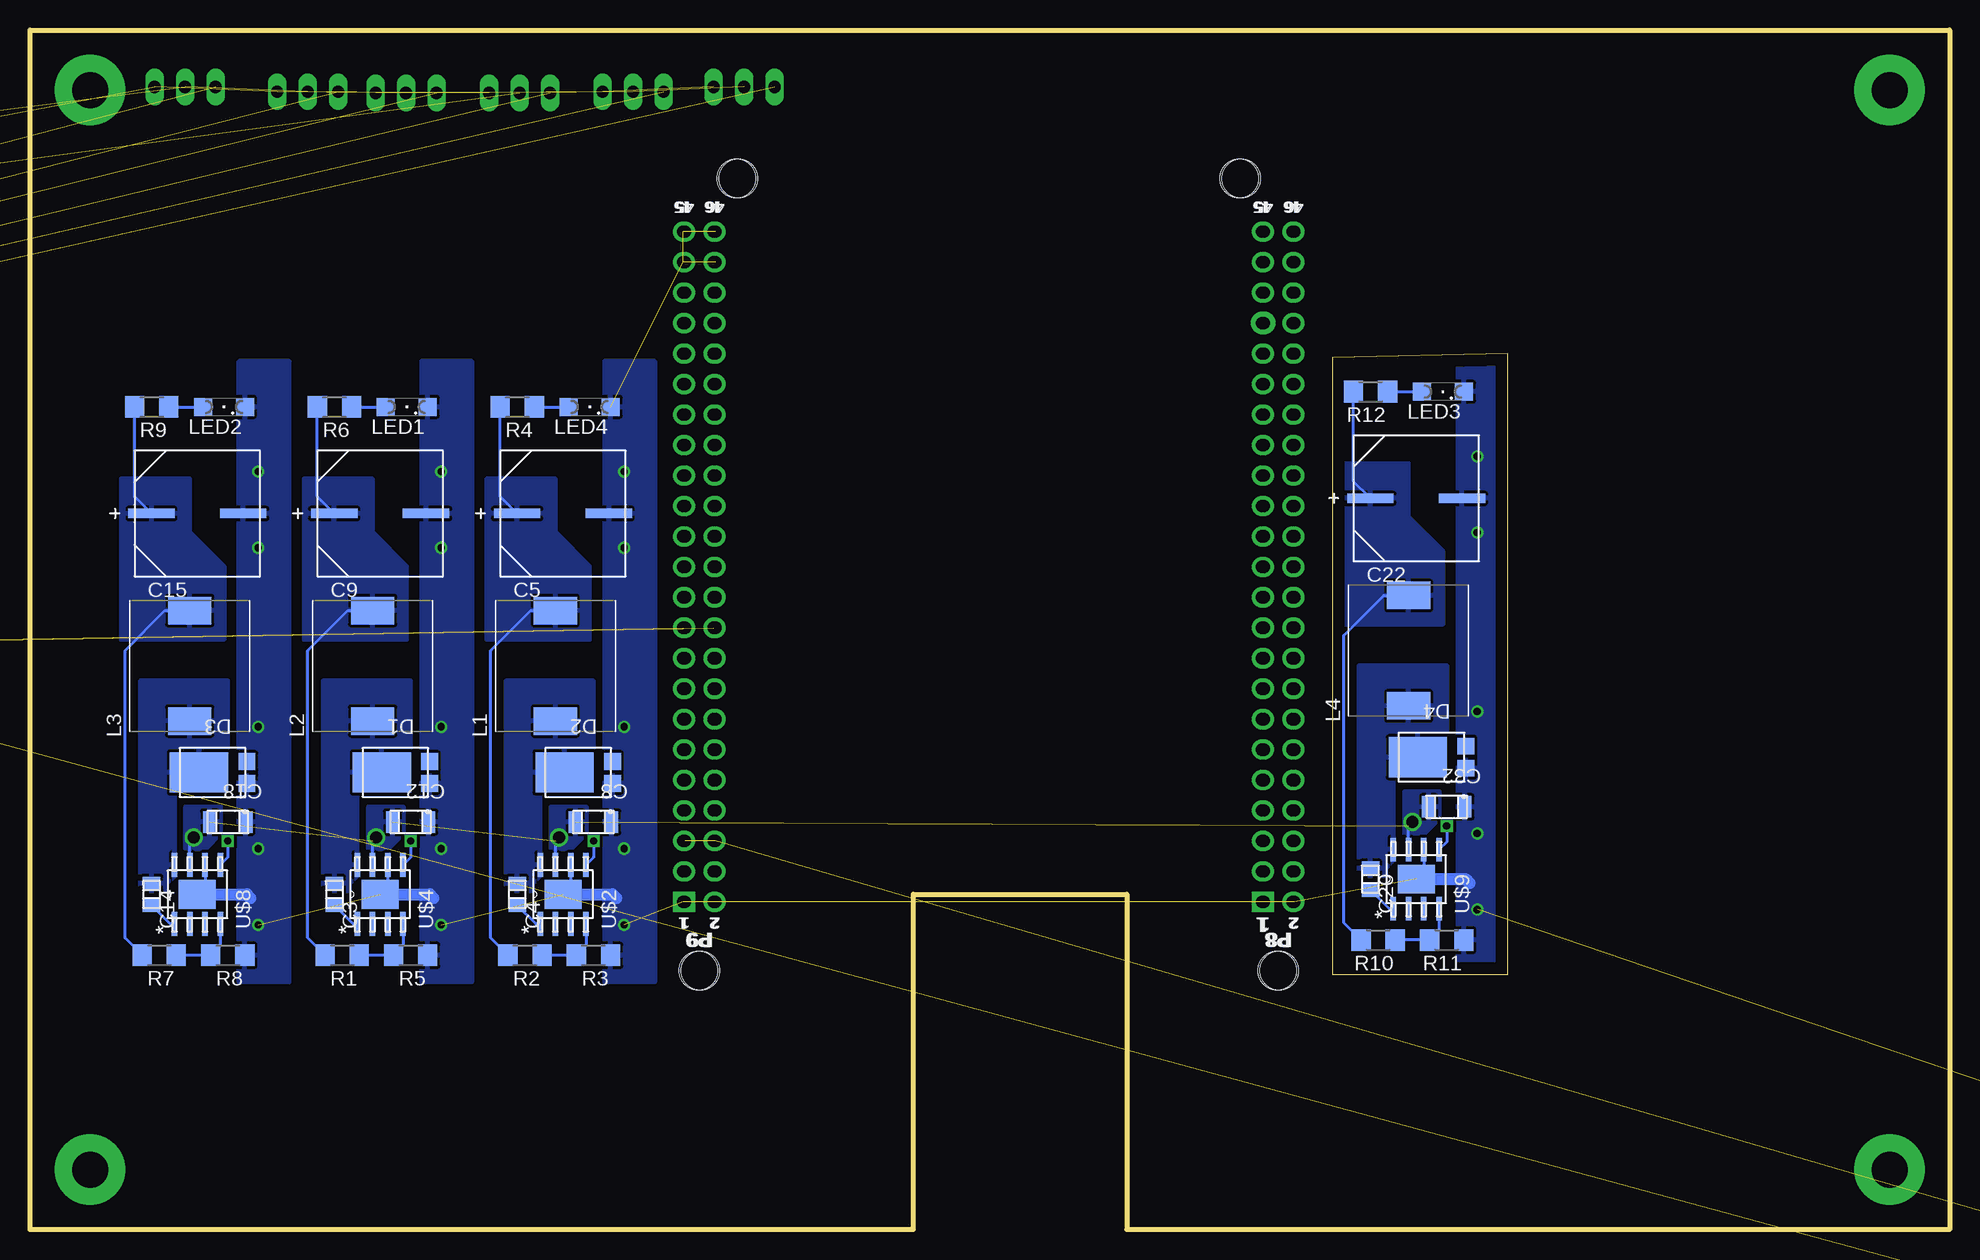
[diagram p9: board, bottom side, seen from below]

Size 160 x 100 mm. Coordinates in mm from the lower left corner, seen from the top.
Outline: 0,0 68.58,0 68.58,27.94 86.36,27.94 86.36,0 160,0 160,100 0,100 0,0
Outline: 36.83,21.27 36.83,73 51.42,72.69 51.42,21.27 36.83,21.27
Copper layers (1*16): Top 0.035mm / dielectric 1.5mm / Bottom 0.035mm
Design rules "default": minimum track width 10mil, minimum drill 24mil, track to track 8mil, track to pad 8mil, pad to pad 8mil, via to via 8mil, smd to smd 8mil, copper to edge 40mil, drill to drill 8mil, minimum pad ring 10mil, minimum via ring 8mil, stop-mask expansion 4mil, vias tented up to drill 0mil, thermal gap 10mil

### Footprints (pad centres in the part's own frame; a part is rotated, then mirrored left to right if it is on the bottom)
1206 = smd 1.118 x 1.803: 1 -1.499,0; 2 1.499,0
0805 = smd 1.118 x 1.448: 1 -0.902,0; 2 0.902,0
SM_RADIAL_10AMM = smd 3.861 x 0.787: 1 -3.823,0; 2 3.823,0
C0805 = smd 1.3 x 1.5: 1 -0.95,0; 2 0.95,0
EIA3216 = smd 1.4 x 1.6: A 1.4,0; C -1.4,0
POWERDI5 = smd 1.397 x 1.397: 1 -0.92,-2.857; 2 0.92,-2.857 | smd 3.353 x 4.851: 3 0,1.13
FKIT-LED-1206 = smd 1.6 x 1.803: A -1.422,0; C 1.422,0
3,0-PAD = drill 3 pad 5.842: B3,0 0,0
DIL28-3 = drill 0.813 long: 1 -16.51,-3.81; 2 -13.97,-3.81; 3 -11.43,-3.81; 4 -8.89,-3.81; 5 -6.35,-3.81; 6 -3.81,-3.81; 7 -1.27,-3.81; 8 1.27,-3.81; 9 3.81,-3.81; 10 6.35,-3.81; 11 8.89,-3.81; 12 11.43,-3.81; 13 13.97,-3.81; 14 16.51,-3.81; 15 16.51,3.81; 16 13.97,3.81; 17 11.43,3.81; 18 8.89,3.81; 19 6.35,3.81; 20 3.81,3.81; 21 1.27,3.81; 22 -1.27,3.81; 23 -3.81,3.81; 24 -6.35,3.81; 25 -8.89,3.81; 26 -11.43,3.81; 27 -13.97,3.81; 28 -16.51,3.81
SO28W = smd 0.65 x 1.7: 1 -7.62,-4.78; 2 -6.35,-4.78; 3 -5.08,-4.78; 4 -3.81,-4.78; 5 -2.54,-4.78; 6 -1.27,-4.78; 7 0,-4.78; 8 1.27,-4.78; 9 2.54,-4.78; 10 3.81,-4.78; 11 5.08,-4.78; 12 6.35,-4.78; 13 7.62,-4.78; 14 8.89,-4.78; 15 8.89,4.78; 16 7.62,4.78; 17 6.35,4.78; 18 5.08,4.78; 19 3.81,4.78; 20 2.54,4.78; 21 1.27,4.78; 22 0,4.78; 23 -1.27,4.78; 24 -2.54,4.78; 25 -3.81,4.78; 26 -5.08,4.78; 27 -6.35,4.78; 28 -7.62,4.78
7395-03 = drill 1.016 long: 1 2.54,0; 2 0,0; 3 -2.54,0
WE-HCC_1090 = smd 2.3 x 3.6: 1 -4.6,0; 2 4.6,0
SML1206 = smd 1.5 x 1.5: A 1.75,0; C -1.75,0
LED_CHIPLED_1206 = smd 1.5 x 1.5: A 0,-1.75; C 0,1.75
MOTHER-BOARD-REV5_10-PIN-SMD = smd 0.889 x 2.667: 1 -2.54,1.524; 2 -2.54,-1.524; 3 -1.27,1.524; 4 -1.27,-1.524; 5 0,1.524; 6 0,-1.524; 7 1.27,1.524; 8 1.27,-1.524; 9 2.54,1.524; 10 2.54,-1.524
SOT23 = smd 1 x 1.4: 1 -0.95,-1.1; 2 0.95,-1.1; 3 0,1.1
R1206 = smd 1.6 x 1.803: 1 -1.422,0; 2 1.422,0
R0805 = smd 1.3 x 1.5: 1 -0.95,0; 2 0.95,0
R0805W = smd 1.5 x 1: 1 -1.052,0; 2 1.052,0
M0805 = smd 1.3 x 1.6: 1 -0.95,0; 2 0.95,0
SOT230P696X180-4N = smd 1.6 x 0.838: 1 -3.2,2.311; 2 -3.2,0; 3 -3.2,-2.311 | smd 1.6 x 3.023: 4 3.2,0
BEAGLE_BONE_BLACK_CAPE = drill 1.016 pad 1.676 square: P8.1 20.32,50.165; P9.1 20.32,1.905 | drill 1.016 pad 1.676: P8.2 20.32,52.705; P8.3 22.86,50.165; P8.4 22.86,52.705; P8.5 25.4,50.165; P8.6 25.4,52.705; P8.7 27.94,50.165; P8.8 27.94,52.705; P8.9 30.48,50.165; P8.10 30.48,52.705; P8.11 33.02,50.165; P8.12 33.02,52.705; P8.13 35.56,50.165; P8.14 35.56,52.705; P8.15 38.1,50.165; P8.16 38.1,52.705; P8.17 40.64,50.165; P8.18 40.64,52.705; P8.19 43.18,50.165; P8.20 43.18,52.705; P8.21 45.72,50.165; P8.22 45.72,52.705; P8.23 48.26,50.165; P8.24 48.26,52.705; P8.25 50.8,50.165; P8.26 50.8,52.705; P8.27 53.34,50.165; P8.28 53.34,52.705; P8.29 55.88,50.165; P8.30 55.88,52.705; P8.31 58.42,50.165; P8.32 58.42,52.705; P8.33 60.96,50.165; P8.34 60.96,52.705; P8.35 63.5,50.165; P8.36 63.5,52.705; P8.37 66.04,50.165; P8.38 66.04,52.705; P8.40 68.58,52.705; P8.41 71.12,50.165; P8.42 71.12,52.705; P8.43 73.66,50.165; P8.44 73.66,52.705; P8.45 76.2,50.165; P8.46 76.2,52.705; P9.2 20.32,4.445; P9.3 22.86,1.905; P9.4 22.86,4.445; P9.5 25.4,1.905; P9.6 25.4,4.445; P9.7 27.94,1.905; P9.8 27.94,4.445; P9.9 30.48,1.905; P9.10 30.48,4.445; P9.11 33.02,1.905; P9.12 33.02,4.445; P9.13 35.56,1.905; P9.14 35.56,4.445; P9.15 38.1,1.905; P9.16 38.1,4.445; P9.17 40.64,1.905; P9.18 40.64,4.445; P9.19 43.18,1.905; P9.20 43.18,4.445; P9.21 45.72,1.905; P9.22 45.72,4.445; P9.23 48.26,1.905; P9.24 48.26,4.445; P9.25 50.8,1.905; P9.26 50.8,4.445; P9.27 53.34,1.905; P9.28 53.34,4.445; P9.29 55.88,1.905; P9.30 55.88,4.445; P9.31 58.42,1.905; P9.32 58.42,4.445; P9.33 60.96,1.905; P9.34 60.96,4.445; P9.35 63.5,1.905; P9.36 63.5,4.445; P9.37 66.04,1.905; P9.38 66.04,4.445; P9.39 68.58,1.905; P9.40 68.58,4.445; P9.41 71.12,1.905; P9.42 71.12,4.445; P9.43 73.66,1.905; P9.44 73.66,4.445; P9.45 76.2,1.905; P9.46 76.2,4.445 | drill 1.016 pad 1.88: P8.39 68.58,50.165 | hole 3.175: 14.605,3.175; 80.645,6.35; 80.645,48.26; 14.605,51.435
R-PDSO-G8 = smd 1.981 x 0.457: 1 -2.464,1.905; 2 -2.464,0.635; 3 -2.464,-0.635; 4 -2.464,-1.905; 5 2.464,-1.905; 6 2.464,-0.635; 7 2.464,0.635; 8 2.464,1.905 | smd 2.388 x 3.099: 9 0,0
MC32882_FINAL = smd 1.6 x 1.4: P$1 -4.2,-2.25; P$2 -4.2,2.25; P$3 4.2,2.25; P$4 4.2,-2.25

### Placement (x,y rotation side)
C1  114.62,29.21 0 top
C2  129.86,29.21 0 top
C3  134.62,27.94 90 bottom
C4  119.38,27.94 90 bottom
C5  115.57,59.69 0 bottom
C6  114.62,26.35 0 top
C7  114.62,23.5 0 top
C8  113.03,33.97 180 bottom
C9  130.81,59.69 0 bottom
C10  129.86,26.35 0 top
C11  129.86,23.5 0 top
C12  128.27,33.97 180 bottom
C13  145.1,29.21 0 top
C14  149.86,27.94 90 bottom
C15  146.05,59.69 0 bottom
C16  145.1,26.35 0 top
C17  145.1,23.5 0 top
C18  143.51,33.97 180 bottom
C19  43.5,30.48 0 top
C20  48.26,29.21 90 bottom
C21  275.25,15.33 180 bottom  (outside the outline)
C22  44.45,60.96 0 bottom
C23  282.55,77.55 270 top  (outside the outline)
C24  293.81,77.21 270 top  (outside the outline)
C25  274.57,50.55 180 bottom  (outside the outline)
C26  293.12,50.8 0 bottom  (outside the outline)
C27  267.64,73.84 270 bottom  (outside the outline)
C28  311.81,73.53 270 bottom  (outside the outline)
C29  -245.11,-69.85 0 top  (outside the outline)
C30  43.5,27.62 0 top
C31  43.5,24.77 0 top
C32  41.91,35.24 180 bottom
D1  129.54,38.1 90 bottom
D2  114.3,38.1 90 bottom
D3  144.78,38.1 90 bottom
D4  43.18,39.37 90 bottom
D5  297.36,77.31 90 top  (outside the outline)
D6  279.41,77.62 90 top  (outside the outline)
H1  155,95 0 top
H2  5,95 0 top
H3  155,5 0 top
H4  5,5 0 top
IC1  289.49,50.89 0 top  (outside the outline)
IC2  -245.11,-81.28 0 top  (outside the outline)
J1  100.48,95.25 180 top
J2  109.74,94.85 180 top
J3  119.2,94.75 180 top
J4  128.66,94.75 180 top
J5  136.85,94.85 180 top
J6  147.08,95.25 180 top
L1  116.2,46.99 90 bottom
L2  131.44,46.99 90 bottom
L3  146.69,46.99 90 bottom
L4  45.09,48.26 90 bottom
LED1  128.59,68.58 180 bottom
LED2  143.83,68.58 180 bottom
LED3  42.23,69.85 180 bottom
LED4  113.35,68.58 180 bottom
LED5  306.77,23.25 180 top  (outside the outline)
LED6  304.67,23.29 180 top  (outside the outline)
LED7  302.64,23.29 180 top  (outside the outline)
LED8  300.61,23.29 180 top  (outside the outline)
LED9  298.58,23.29 180 top  (outside the outline)
PROGRAMMING  287.2,17.96 180 top  (outside the outline)
Q1  129.86,36.83 180 top
Q2  114.62,36.83 180 top
Q3  145.1,36.83 180 top
Q4  43.5,38.1 180 top
R1  133.99,22.86 180 bottom
R2  118.75,22.86 180 bottom
R3  113.03,22.86 180 bottom
R4  119.38,68.58 180 bottom
R5  128.27,22.86 180 bottom
R6  134.62,68.58 180 bottom
R7  149.22,22.86 180 bottom
R8  143.51,22.86 180 bottom
R9  149.86,68.58 180 bottom
R10  47.62,24.13 180 bottom
R11  41.91,24.13 180 bottom
R12  48.26,69.85 180 bottom
R13  273.59,42.36 270 bottom  (outside the outline)
R14  271.65,38.32 0 bottom  (outside the outline)
R15  295.67,73.1 0 top  (outside the outline)
R16  280.95,72.99 0 top  (outside the outline)
R17  -254,-72.39 0 top  (outside the outline)
R19  308.18,4.33 90 bottom  (outside the outline)
R20  300.28,5.73 90 bottom  (outside the outline)
R21  307.04,28.47 90 top  (outside the outline)
R22  304.75,28.45 90 top  (outside the outline)
R23  302.69,28.45 90 top  (outside the outline)
R24  300.61,28.42 90 top  (outside the outline)
R25  298.5,28.32 90 top  (outside the outline)
U3  288.02,74.78 270 top  (outside the outline)
U$1  107.47,6.99 90 top
U$2  115.57,27.94 90 bottom
U$3  107.31,6.99 90 top
U$4  130.81,27.94 90 bottom
U$5  271.98,4.85 90 top  (outside the outline)
U$6  308.53,-0.69 90 top  (outside the outline)
U$7  300.53,-0.59 90 top  (outside the outline)
U$8  146.05,27.94 90 bottom
U$9  44.45,29.21 90 bottom

### Tracks (layer width: path | path; a pad name or v marks a point on that pad's centre or on a via)
3.3V  (13 unrouted)
6V_INPUT1  (3 unrouted)
6V_INPUT2  (3 unrouted)
+5V  (3 unrouted)
BOOT1
  Bottom 0.254: U$2.1 117.82,25.48 C4.1
BOOT2
  Bottom 0.254: U$4.1 133.06,25.48 C3.1
BOOT3
  Bottom 0.254: U$8.1 148.3,25.48 C14.1
BOOT4
  Bottom 0.254: U$9.1 46.7,26.75 C20.1
ENA_1  (via drill 0.6)
  Top 0.254: Q2.3 114.62,33.97 v113.03,32.38
  Bottom 0.254: v113.03,32.38 113.03,31.04 U$2.5
ENA_2  (via drill 0.6)
  Top 0.254: Q1.3 129.86,33.97 v128.27,32.38
  Bottom 0.254: v128.27,32.38 128.27,31.04 U$4.5
ENA_3  (via drill 0.6)
  Top 0.254: Q3.3 145.1,33.97 v143.51,32.38
  Bottom 0.254: v143.51,32.38 143.51,31.04 U$8.5
ENA_4  (via drill 0.6)
  Top 0.254: Q4.3 43.5,35.24 v41.91,33.66
  Bottom 0.254: v41.91,33.66 41.91,32.31 U$9.5
GND  (via drill 0.6)  (20 unrouted)
  Bottom 0.254: U$2.6 114.94,27.94 | U$4.6 130.18,27.94 | U$8.6 145.41,27.94 | U$9.6 43.81,29.21
  Bottom 1.016: U$2.9 114.94,27.94 111.44,27.94 111.12,27.62 | U$4.9 130.18,27.94 126.68,27.94 126.36,27.62 | U$8.9 145.41,27.94 141.92,27.94 141.6,27.62 | U$9.9 43.81,29.21 40.32,29.21 40.01,28.89
  other vias: 110.49,25.4 110.49,31.75 110.49,41.91 110.49,56.83 110.49,63.18 125.73,25.4 125.73,31.75 125.73,41.91 125.73,56.83 125.73,63.18 140.97,25.4 140.97,31.75 140.97,41.91 140.97,56.83 140.97,63.18 39.37,26.67 39.37,33.02 39.37,43.18 39.37,58.1 39.37,64.45
  pour Top: 113.98,20.64 113.98,72.39 107.95,72.39 107.95,20.64
  pour Bottom: 112.08,20.64 112.08,72.39 107.95,72.39 107.95,20.64
  pour Top: 129.22,20.64 129.22,72.39 123.19,72.39 123.19,20.64
  pour Bottom: 127.32,20.64 127.32,72.39 123.19,72.39 123.19,20.64
  pour Top: 144.46,20.64 144.46,72.39 138.43,72.39 138.43,20.64
  pour Bottom: 142.56,20.64 142.56,72.39 138.43,72.39 138.43,20.64
  pour Top: 42.86,21.91 42.86,73.66 36.83,73.66 36.83,21.91
  pour Bottom: 40.96,21.91 40.96,73.66 36.83,73.66 36.83,21.91
IO1  (3 unrouted)
IO2  (3 unrouted)
IO3  (1 unrouted)
IO4  (1 unrouted)
IO5  (1 unrouted)
IO6  (1 unrouted)
IO7  (1 unrouted)
MCLR  (6 unrouted)
N$1
  Bottom 0.254: R4.1 LED4.A
N$2
  Bottom 0.254: R6.1 LED1.A
N$3
  Bottom 0.254: R9.1 LED2.A
N$4
  Bottom 0.254: R12.1 LED3.A
N$5  (1 unrouted)
N$6  (1 unrouted)
N$7  (1 unrouted)
N$8  (1 unrouted)
N$9  (1 unrouted)
N$10  (1 unrouted)
N$11  (3 unrouted)
N$13  (1 unrouted)
OC1  (1 unrouted)
OC2  (1 unrouted)
OC3  (1 unrouted)
OC4  (1 unrouted)
OC5  (1 unrouted)
OC6  (1 unrouted)
PGC1  (2 unrouted)
PGD1  (2 unrouted)
PH1
  pour Bottom: 120.33,28.26 118.11,28.26 118.11,28.89 117.47,29.53 117.47,36.2 113.03,39.37 113.03,45.72 120.33,45.72
PH2
  pour Bottom: 135.57,28.26 133.35,28.26 133.35,28.89 132.72,29.53 132.72,36.2 128.27,39.37 128.27,45.72 135.57,45.72
PH3
  pour Bottom: 150.81,28.26 148.59,28.26 148.59,28.89 147.96,29.53 147.96,36.2 143.51,39.37 143.51,45.72 150.81,45.72
PH4
  pour Bottom: 49.21,29.53 46.99,29.53 46.99,30.16 46.35,30.8 46.35,37.47 41.91,40.64 41.91,46.99 49.21,46.99
SCL  (1 unrouted)
SDA  (1 unrouted)
VCC  (via drill 1)  (3 unrouted)
  Bottom 0.254: U$2.7 116.2,32.38 v115.89,32.7 | U$4.7 131.44,32.38 v131.13,32.7 | U$8.7 146.69,32.38 v146.37,32.7 | U$9.7 45.09,33.66 v44.77,33.97
  pour Top: 115.25,20.64 115.25,33.66 118.43,33.66 118.43,20.64
  pour Bottom: 114.94,31.75 116.52,31.75 116.52,35.24 113.67,35.24 113.67,33.02
  pour Top: 130.49,20.64 130.49,33.66 133.67,33.66 133.67,20.64
  pour Bottom: 130.18,31.75 131.76,31.75 131.76,35.24 128.91,35.24 128.91,33.02
  pour Top: 145.73,20.64 145.73,33.66 148.91,33.66 148.91,20.64
  pour Bottom: 145.41,31.75 147,31.75 147,35.24 144.15,35.24 144.15,33.02
  pour Top: 44.13,21.91 44.13,34.92 47.31,34.92 47.31,21.91
  pour Bottom: 43.81,33.02 45.4,33.02 45.4,36.51 42.55,36.51 42.55,34.29
VOUT1
  Bottom 0.254: R2.2 121.6,24.3 121.6,48.26 118.27,51.59 L1.2 | C5.1 120.8,61.1 R4.2
  pour Bottom: 121.92,49.21 113.35,49.21 113.35,55.24 116.2,58.1 116.2,62.55 121.92,62.55
VOUT2
  Bottom 0.254: R1.2 136.84,24.3 136.84,48.26 133.51,51.59 L2.2 | C9.1 136.04,61.1 R6.2
  pour Bottom: 137.16,49.21 128.59,49.21 128.59,55.24 131.44,58.1 131.44,62.55 137.16,62.55
VOUT3
  Bottom 0.254: R7.2 152.08,24.3 152.08,48.26 148.75,51.59 L3.2 | C15.1 151.28,61.1 R9.2
  pour Bottom: 152.4,49.21 143.83,49.21 143.83,55.24 146.69,58.1 146.69,62.55 152.4,62.55
VOUT4
  Bottom 0.254: R10.2 50.48,25.57 50.48,49.53 47.15,52.86 L4.2 | C22.1 49.68,62.37 R12.2
  pour Bottom: 50.8,50.48 42.23,50.48 42.23,56.52 45.09,59.37 45.09,63.82 50.8,63.82
VSNS1
  Bottom 0.254: R2.1 R3.2 113.67,23.65 U$2.4
VSNS2
  Bottom 0.254: R1.1 R5.2 128.91,23.65 U$4.4
VSNS3
  Bottom 0.254: R7.1 R8.2 144.15,23.65 U$8.4
VSNS4
  Bottom 0.254: R10.1 R11.2 42.55,24.92 U$9.4
VSS  (28 unrouted)

### Text on the board
tPlace: Servo 1 | Servo 6 | 5V | User LEDs | S1 | S2